# Altium project EMRT EVENT CONTROLER.PrjPCB (part 1 of 2)
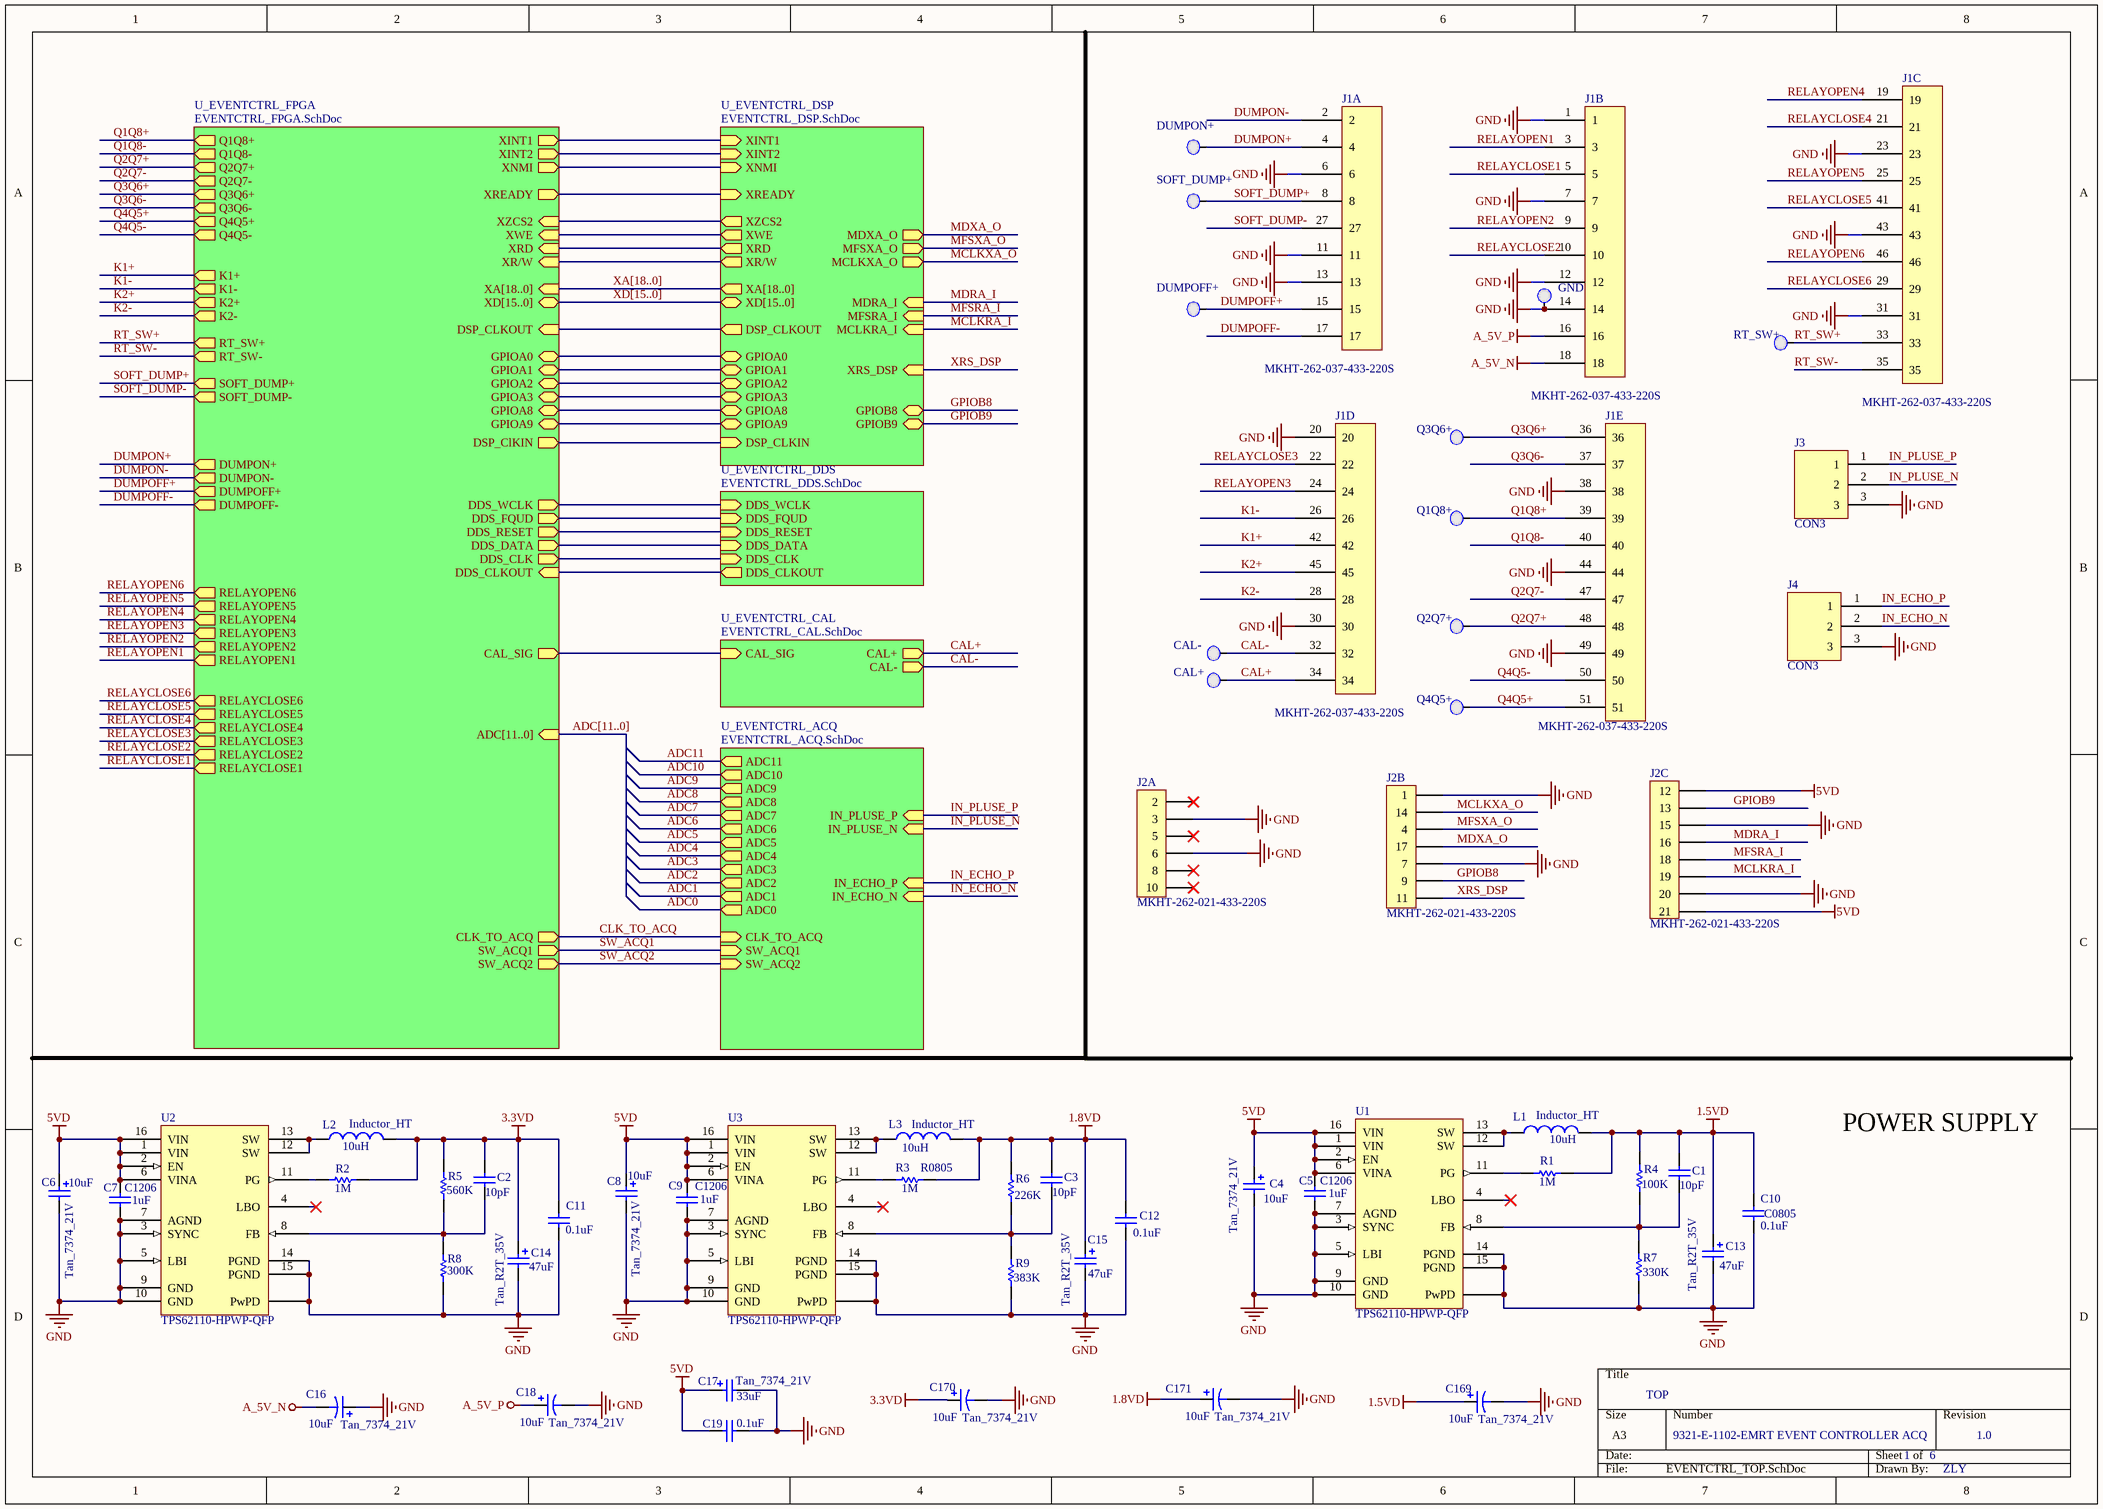
[diagram p0: EVENTCTRL_TOP.SchDoc]
6 sheets, 367 parts. Net scope: hierarchical (ports join the sheet entries above them; power ports are global).
Board file: Multi_EMRT_EC.PcbDoc
Sheets:
  EVENTCTRL_TOP.SchDoc
    U_EVENTCTRL_CAL = EVENTCTRL_CAL.SchDoc
    U_EVENTCTRL_DDS = EVENTCTRL_DDS.SchDoc
    U_EVENTCTRL_ACQ = EVENTCTRL_ACQ.SchDoc
    U_EVENTCTRL_DSP = EVENTCTRL_DSP.SchDoc
    U_EVENTCTRL_FPGA = EVENTCTRL_FPGA.SchDoc

## Sheet EVENTCTRL_TOP.SchDoc: TOP
size A3; Author: ZLY; DocumentNumber: 9321-E-1102-EMRT EVENT CONTROLLER ACQ; Revision: 1.0; SheetNumber: 1; SheetTotal: 6

### Parts
C1  value 10pF  [0805]  (hidden comment: C0805)
C2  value 10pF  [0805]  (hidden comment: C0805)
C3  value 10pF  [0805]  (hidden comment: C0805)
C4  Tan_7374_21V  value 10uF  [7343]
C5  C1206  value 1uF  [1206]
C6  Tan_7374_21V  value 10uF  [7343]
C7  C1206  value 1uF  [1206]
C8  Tan_7374_21V  value 10uF  [7343]
C9  C1206  value 1uF  [1206]
C10  C0805  value 0.1uF  [0805]
C11  value 0.1uF  [0805]  (hidden comment: C0805)
C12  value 0.1uF  [0805]  (hidden comment: C0805)
C13  Tan_R2T_35V  value 47uF  [7343]
C14  Tan_R2T_35V  value 47uF  [7343]
C15  Tan_R2T_35V  value 47uF  [7343]
C16  Tan_7374_21V  value 10uF  [7343]
C17  Tan_7374_21V  value 33uF  [7343]
C18  Tan_7374_21V  value 10uF  [7343]
C19  value 0.1uF  [0805]  (hidden comment: C0805)
C169  Tan_7374_21V  value 10uF  [7343]
C170  Tan_7374_21V  value 10uF  [7343]
C171  Tan_7374_21V  value 10uF  [7343]
CAL+  TP  [TPA]  (value not drawn)
CAL-  TP  [TPA]  (value not drawn)
DUMPOFF+  TP  [TPA]  (value not drawn)
DUMPON+  TP  [TPA]  (value not drawn)
GND  TP  [TPA]  (value not drawn)
J1  MKHT-262-037-433-220S  [MKHT-262-037-433-220S-51]  (parts A,B,C,D,E of 5)
J2  MKHT-262-021-433-220S  [AIRBORN_21]  (parts A,B,C of 3)
J3  CON3  [HEAT3]
J4  CON3  [HEAT3]
L1  Inductor_HT  value 10uH  [Inductor_HT]
L2  Inductor_HT  value 10uH  [Inductor_HT]
L3  Inductor_HT  value 10uH  [Inductor_HT]
Q1Q8+  TP  [TPA]  (value not drawn)
Q2Q7+  TP  [TPA]  (value not drawn)
Q3Q6+  TP  [TPA]  (value not drawn)
Q4Q5+  TP  [TPA]  (value not drawn)
R1  value 1M  [R0805]  (hidden comment: R0805)
R2  value 1M  [R0805]  (hidden comment: R0805)
R3  R0805  value 1M  [R0805]
R4  value 100K  [R0805]  (hidden comment: R0805)
R5  value 560K  [R0805]  (hidden comment: R0805)
R6  value 226K  [R0805]  (hidden comment: R0805)
R7  value 330K  [R0805]  (hidden comment: R0805)
R8  value 300K  [R0805]  (hidden comment: R0805)
R9  value 383K  [R0805]  (hidden comment: R0805)
RT_SW+  TP  [TPA]  (value not drawn)
SOFT_DUMP+  TP  [TPA]  (value not drawn)
U1  TPS62110-HPWP-QFP  [PWP16]
U2  TPS62110-HPWP-QFP  [PWP16]
U3  TPS62110-HPWP-QFP  [PWP16]

### Sub-sheets
U_EVENTCTRL_ACQ = EVENTCTRL_ACQ.SchDoc: IN_PLUSE_N (in), IN_PLUSE_P (in), IN_ECHO_N (in), IN_ECHO_P (in), SW_ACQ1 (in), SW_ACQ2 (in), CLK_TO_ACQ (in), ADC6 (out), ADC11 (out), ADC2 (out), ADC4 (out), ADC9 (out), ADC3 (out), ADC8 (out), ADC7 (out), ADC1 (out), ADC0 (out), ADC10 (out), ADC5 (out)
U_EVENTCTRL_CAL = EVENTCTRL_CAL.SchDoc: CAL_SIG (in), CAL+ (out), CAL- (out)
U_EVENTCTRL_DDS = EVENTCTRL_DDS.SchDoc: DDS_WCLK (in), DDS_FQUD (in), DDS_CLK (in), DDS_RESET (in), DDS_DATA (in), DDS_CLKOUT (out)
U_EVENTCTRL_DSP = EVENTCTRL_DSP.SchDoc: XZCS2 (out), XWE (out), XRD (out), XR/W (out), XREADY (in), DSP_CLKOUT (out), XINT1 (in), XINT2 (in), XNMI (in), GPIOA0 (bidir), GPIOA1 (bidir), GPIOA2 (bidir), GPIOA3 (bidir), MDXA_O (out), MFSXA_O (out), MCLKXA_O (out), MDRA_I (in), MFSRA_I (in), MCLKRA_I (in), XRS_DSP (in), XD[15..0] (bidir), XA[18..0] (out), GPIOB8 (bidir), GPIOB9 (bidir), GPIOA9 (bidir), GPIOA8 (bidir), DSP_CLKIN (in)
U_EVENTCTRL_FPGA = EVENTCTRL_FPGA.SchDoc: DDS_CLKOUT (in), XINT1 (out), XINT2 (out), XNMI (out), DDS_WCLK (out), DDS_FQUD (out), DDS_DATA (out), DDS_RESET (out), DSP_CLKOUT (in), XWE (in), XRD (in), GPIOA0 (bidir), GPIOA1 (bidir), GPIOA2 (bidir), GPIOA3 (bidir), XR/W (in), XREADY (out), XD[15..0] (bidir), XA[18..0] (in), Q1Q8+ (out), Q1Q8- (out), Q2Q7+ (out), Q2Q7- (out), Q3Q6+ (out), Q3Q6- (out), Q4Q5+ (out), Q4Q5- (out), DUMPON+ (out), DUMPON- (out), K1+ (out), K1- (out), RT_SW+ (out), RT_SW- (out), DUMPOFF+ (out), DUMPOFF- (out), K2+ (out), K2- (out), SOFT_DUMP+ (out), SOFT_DUMP- (out), GPIOA8 (bidir), GPIOA9 (bidir), CAL_SIG (out), SW_ACQ2 (out), SW_ACQ1 (out), CLK_TO_ACQ (out), DDS_CLK (out), XZCS2 (in), ADC[11..0] (in), RELAYOPEN6 (out), RELAYCLOSE4 (out), RELAYCLOSE6 (out), RELAYOPEN4 (out), RELAYCLOSE5 (out), RELAYOPEN1 (out), RELAYCLOSE2 (out), RELAYOPEN5 (out), RELAYCLOSE1 (out), RELAYOPEN3 (out), RELAYCLOSE3 (out), RELAYOPEN2 (out), DSP_ClKIN (out)

### Nets
1.5VD: C1.2 C10.2 C13.1 C169.1 L1.2 R1.2 R4.2
1.8VD: C3.2 C12.2 C15.1 C171.1 L3.2 R3.2 R6.2
3.3VD: C2.2 C11.2 C14.1 C170.1 L2.2 R2.2 R5.2
5VD: C4.1 C5.2 C6.1 C7.2 C8.1 C9.2 C17.1 C19.2 J2.12 J2.21 U1.1(VIN) U1.2(EN) U1.6(VINA) U1.16(VIN) U2.1(VIN) U2.2(EN) U2.6(VINA) U2.16(VIN) U3.1(VIN) U3.2(EN) U3.6(VINA) U3.16(VIN)
A_5V_N: C16.2 J1.18
A_5V_P: C18.1 J1.16
GND: C4.2 C5.1 C6.2 C7.1 C8.2 C9.1 C10.1 C11.1 C12.1 C13.2 C14.2 C15.2 C16.1 C17.2 C18.2 C19.1 C169.2 C170.2 C171.2 GND.1(TP) J1.1 J1.6 J1.7 J1.11 J1.12 J1.13 J1.14 J1.20 J1.23 J1.30 J1.31 J1.38 J1.43 J1.44 J1.49 J2.1 J2.3 J2.6 J2.7 J2.15 J2.20 J3.3 J4.3 R7.1 R8.1 R9.1 U1.3(SYNC) U1.5(LBI) U1.7(AGND) U1.9(GND) U1.10(GND) U1.14(PGND) U1.15(PGND) U1.PwPD U2.3(SYNC) U2.5(LBI) U2.7(AGND) U2.9(GND) U2.10(GND) U2.14(PGND) U2.15(PGND) U2.PwPD U3.3(SYNC) U3.5(LBI) U3.7(AGND) U3.9(GND) U3.10(GND) U3.14(PGND) U3.15(PGND) U3.PwPD
CAL+: CAL+.1(TP) J1.34 ; sheet U_EVENTCTRL_CAL/CAL+
CAL-: CAL-.1(TP) J1.32 ; sheet U_EVENTCTRL_CAL/CAL-
CLK_TO_ACQ: sheet U_EVENTCTRL_ACQ/CLK_TO_ACQ, sheet U_EVENTCTRL_FPGA/CLK_TO_ACQ
DUMPOFF+: DUMPOFF+.1(TP) J1.15 ; sheet U_EVENTCTRL_FPGA/DUMPOFF+
DUMPOFF-: J1.17 ; sheet U_EVENTCTRL_FPGA/DUMPOFF-
DUMPON+: DUMPON+.1(TP) J1.4 ; sheet U_EVENTCTRL_FPGA/DUMPON+
DUMPON-: J1.2 ; sheet U_EVENTCTRL_FPGA/DUMPON-
GPIOB8: J2.9 ; sheet U_EVENTCTRL_DSP/GPIOB8
GPIOB9: J2.13 ; sheet U_EVENTCTRL_DSP/GPIOB9
IN_ECHO_N: J4.2 ; sheet U_EVENTCTRL_ACQ/IN_ECHO_N
IN_ECHO_P: J4.1 ; sheet U_EVENTCTRL_ACQ/IN_ECHO_P
IN_PLUSE_N: J3.2 ; sheet U_EVENTCTRL_ACQ/IN_PLUSE_N
IN_PLUSE_P: J3.1 ; sheet U_EVENTCTRL_ACQ/IN_PLUSE_P
K1+: J1.42 ; sheet U_EVENTCTRL_FPGA/K1+
K1-: J1.26 ; sheet U_EVENTCTRL_FPGA/K1-
K2+: J1.45 ; sheet U_EVENTCTRL_FPGA/K2+
K2-: J1.28 ; sheet U_EVENTCTRL_FPGA/K2-
MCLKRA_I: J2.19 ; sheet U_EVENTCTRL_DSP/MCLKRA_I  [project net MCLKRA]
MCLKXA_O: J2.14 ; sheet U_EVENTCTRL_DSP/MCLKXA_O  [project net MCLKXA]
MDRA_I: J2.16 ; sheet U_EVENTCTRL_DSP/MDRA_I  [project net MDRA]
MDXA_O: J2.17 ; sheet U_EVENTCTRL_DSP/MDXA_O  [project net MDXA]
MFSRA_I: J2.18 ; sheet U_EVENTCTRL_DSP/MFSRA_I  [project net MFSRA]
MFSXA_O: J2.4 ; sheet U_EVENTCTRL_DSP/MFSXA_O  [project net MFSXA]
Q1Q8+: J1.39 Q1Q8+.1(TP) ; sheet U_EVENTCTRL_FPGA/Q1Q8+
Q1Q8-: J1.40 ; sheet U_EVENTCTRL_FPGA/Q1Q8-
Q2Q7+: J1.48 Q2Q7+.1(TP) ; sheet U_EVENTCTRL_FPGA/Q2Q7+
Q2Q7-: J1.47 ; sheet U_EVENTCTRL_FPGA/Q2Q7-
Q3Q6+: J1.36 Q3Q6+.1(TP) ; sheet U_EVENTCTRL_FPGA/Q3Q6+
Q3Q6-: J1.37 ; sheet U_EVENTCTRL_FPGA/Q3Q6-
Q4Q5+: J1.51 Q4Q5+.1(TP) ; sheet U_EVENTCTRL_FPGA/Q4Q5+
Q4Q5-: J1.50 ; sheet U_EVENTCTRL_FPGA/Q4Q5-
RELAYCLOSE1: J1.5 ; sheet U_EVENTCTRL_FPGA/RELAYCLOSE1
RELAYCLOSE2: J1.10 ; sheet U_EVENTCTRL_FPGA/RELAYCLOSE2
RELAYCLOSE3: J1.22 ; sheet U_EVENTCTRL_FPGA/RELAYCLOSE3
RELAYCLOSE4: J1.21 ; sheet U_EVENTCTRL_FPGA/RELAYCLOSE4
RELAYCLOSE5: J1.41 ; sheet U_EVENTCTRL_FPGA/RELAYCLOSE5
RELAYCLOSE6: J1.29 ; sheet U_EVENTCTRL_FPGA/RELAYCLOSE6
RELAYOPEN1: J1.3 ; sheet U_EVENTCTRL_FPGA/RELAYOPEN1
RELAYOPEN2: J1.9 ; sheet U_EVENTCTRL_FPGA/RELAYOPEN2
RELAYOPEN3: J1.24 ; sheet U_EVENTCTRL_FPGA/RELAYOPEN3
RELAYOPEN4: J1.19 ; sheet U_EVENTCTRL_FPGA/RELAYOPEN4
RELAYOPEN5: J1.25 ; sheet U_EVENTCTRL_FPGA/RELAYOPEN5
RELAYOPEN6: J1.46 ; sheet U_EVENTCTRL_FPGA/RELAYOPEN6
RT_SW+: J1.33 RT_SW+.1(TP) ; sheet U_EVENTCTRL_FPGA/RT_SW+
RT_SW-: J1.35 ; sheet U_EVENTCTRL_FPGA/RT_SW-
SOFT_DUMP+: J1.8 SOFT_DUMP+.1(TP) ; sheet U_EVENTCTRL_FPGA/SOFT_DUMP+
SOFT_DUMP-: J1.27 ; sheet U_EVENTCTRL_FPGA/SOFT_DUMP-
SW_ACQ1: sheet U_EVENTCTRL_ACQ/SW_ACQ1, sheet U_EVENTCTRL_FPGA/SW_ACQ1
SW_ACQ2: sheet U_EVENTCTRL_ACQ/SW_ACQ2, sheet U_EVENTCTRL_FPGA/SW_ACQ2
XR/W: sheet U_EVENTCTRL_DSP/XR/W, sheet U_EVENTCTRL_FPGA/XR/W
XRD: sheet U_EVENTCTRL_DSP/XRD, sheet U_EVENTCTRL_FPGA/XRD
XRS_DSP: J2.11 ; sheet U_EVENTCTRL_DSP/XRS_DSP
XWE: sheet U_EVENTCTRL_DSP/XWE, sheet U_EVENTCTRL_FPGA/XWE
NetC1_1: C1.1 R4.1 R7.2 U1.8(FB)
NetC2_1: C2.1 R5.1 R8.2 U2.8(FB)
NetC3_1: C3.1 R6.1 R9.2 U3.8(FB)
NetL1_1: L1.1 U1.12(SW) U1.13(SW)
NetL2_1: L2.1 U2.12(SW) U2.13(SW)
NetL3_1: L3.1 U3.12(SW) U3.13(SW)
NetR1_1: R1.1 U1.11(PG)
NetR2_1: R2.1 U2.11(PG)
NetR3_1: R3.1 U3.11(PG)
NetR90_1: sheet U_EVENTCTRL_CAL/CAL_SIG, sheet U_EVENTCTRL_FPGA/CAL_SIG
NetR107_1: sheet U_EVENTCTRL_DSP/DSP_CLKOUT, sheet U_EVENTCTRL_FPGA/DSP_CLKOUT
NetR109_1: sheet U_EVENTCTRL_DSP/GPIOA0, sheet U_EVENTCTRL_FPGA/GPIOA0
NetR110_1: sheet U_EVENTCTRL_DSP/GPIOA1, sheet U_EVENTCTRL_FPGA/GPIOA1
NetR111_1: sheet U_EVENTCTRL_DSP/GPIOA2, sheet U_EVENTCTRL_FPGA/GPIOA2
NetR112_1: sheet U_EVENTCTRL_DSP/GPIOA3, sheet U_EVENTCTRL_FPGA/GPIOA3
NetR113_1: sheet U_EVENTCTRL_DSP/GPIOA8, sheet U_EVENTCTRL_FPGA/GPIOA8
NetR114_1: sheet U_EVENTCTRL_DSP/GPIOA9, sheet U_EVENTCTRL_FPGA/GPIOA9
NetR116_1: sheet U_EVENTCTRL_DSP/XINT1, sheet U_EVENTCTRL_FPGA/XINT1
NetR118_1: sheet U_EVENTCTRL_DSP/XINT2, sheet U_EVENTCTRL_FPGA/XINT2
NetR120_1: sheet U_EVENTCTRL_DSP/XNMI, sheet U_EVENTCTRL_FPGA/XNMI
NetR134_1: sheet U_EVENTCTRL_DSP/DSP_CLKIN, sheet U_EVENTCTRL_FPGA/DSP_ClKIN
NetTP21_1: sheet U_EVENTCTRL_DDS/DDS_CLK, sheet U_EVENTCTRL_FPGA/DDS_CLK
NetTP22_1: sheet U_EVENTCTRL_DDS/DDS_CLKOUT, sheet U_EVENTCTRL_FPGA/DDS_CLKOUT
NetU15_7: sheet U_EVENTCTRL_DDS/DDS_WCLK, sheet U_EVENTCTRL_FPGA/DDS_WCLK
NetU15_8: sheet U_EVENTCTRL_DDS/DDS_FQUD, sheet U_EVENTCTRL_FPGA/DDS_FQUD
NetU15_22: sheet U_EVENTCTRL_DDS/DDS_RESET, sheet U_EVENTCTRL_FPGA/DDS_RESET
NetU15_25: sheet U_EVENTCTRL_DDS/DDS_DATA, sheet U_EVENTCTRL_FPGA/DDS_DATA
NetU16_88: sheet U_EVENTCTRL_DSP/XZCS2, sheet U_EVENTCTRL_FPGA/XZCS2
NetU16_161: sheet U_EVENTCTRL_DSP/XREADY, sheet U_EVENTCTRL_FPGA/XREADY

Not connected (* = marked no-connect by the designer): J2 2* 5* 8* 10*; U1 4(LBO)*; U2 4(LBO)*; U3 4(LBO)*

### Buses and harness runs
bus ADC[11..0] = sheet U_EVENTCTRL_FPGA/ADC[11..0]
bus XA[18..0] = sheet U_EVENTCTRL_DSP/XA[18..0] = sheet U_EVENTCTRL_FPGA/XA[18..0]
bus XD[15..0] = sheet U_EVENTCTRL_DSP/XD[15..0] = sheet U_EVENTCTRL_FPGA/XD[15..0]

### Notes on the sheet
- POWER SUPPLY

### Library data of the parts
C1-C3 = Y20025162: Capacitor; 制造商型号: 0805D100J500P; parent: 01; 精度: ±5%; 描述: NOVACAP;0805D100J500P;10pF;30±ppm/℃;±5%;50V;C0G/NP0;200℃;CAP0805; 安装形式: SMT; 湿敏等级（回流焊峰值）: 0; 产品外形尺寸<长>: 0.080±0.008 in; 产品外形尺寸<宽>: 0.050±0.008 in; 产品外形尺寸<高>: 0.054 in; id: wt.part.WTPartMaster:1047283; state: APPROVED; folder: /Default/电容/0805D100J500P; Part Number: Y20025162; HelpURL: \\10.185.226.160\altium_center_db\DATASHEET\NOVACAP High Temperature Chip.pdf; Library Path: Cap.SchLib; Library Ref: Cap; Footprint Path: NOVACAP 0805.PcbLib; Footprint Ref: CAPS0805_54; pname: 0805D100J500P; Library Path 2: 0; Library Ref 2: 0; Footprint Path 2: 0; Footprint Ref 2: 0; Footprint Path 3: 0; Footprint Ref 3: 0
C4 C6 C8 = Y20024815: Polarized Capacitor; 制造商型号: T499C106K025AT; parent: 01; 精度: ±10%; 描述: KEMET;T499C106K025AT;10uF;±10%;25V;175℃;CAP2312; 安装形式: SMT; 湿敏等级（回流焊峰值）: 0; 产品外形尺寸<长>: 3.2±0.30 mm; 产品外形尺寸<宽>: 6.0±0.30 mm; 产品外形尺寸<高>: 2.5±0.30 mm; id: wt.part.WTPartMaster:1056571; state: APPROVED; folder: /Default/电容/T499C106K025AT; 耐压值: 21V; Part Number: Y20024815; HelpURL: \\10.185.226.160\altium_center_db\DATASHEET\KEMET T498&T499ns.pdf; Library Path: Cap Pol.SchLib; Library Ref: Cap Pol; Footprint Path: KEMET T499-C.PcbLib; Footprint Ref: CAPSP_2q2312_110; pname: T499C106K025AT; Library Path 2: 0; Library Ref 2: 0; Footprint Path 2: 0; Footprint Ref 2: 0; Footprint Path 3: 0; Footprint Ref 3: 0
C5 C7 C9 = Y20024113: Capacitor; 制造商型号: C1206C105K5RAC; parent: 01; 精度: ±10%; 描述: KEMET;C1206C105K5RAC;1uF;±10%;50V;X7R;125℃;CAP1206 MSL1; 安装形式: SMT; 湿敏等级（回流焊峰值）: MSL1; 产品外形尺寸<长>: 3.2±0.2 mm; 产品外形尺寸<宽>: 1.6±0.2 mm; 产品外形尺寸<高>: 1.0±0.1 mm; Library Path 2: 0; id: wt.part.WTPartMaster:1055130; state: APPROVED; folder: /Default/电容/C1206C105K5RAC; Part Number: Y20024113; HelpURL: \\10.185.226.160\altium_center_db\DATASHEET\KEMET X7R Dielectric(Commercial Grade).pdf; Library Path: Cap.SchLib; Library Ref: Cap; Footprint Path: KEMET C1206_43.PcbLib; Footprint Ref: CAPS1206_43; pname: C1206C105K5RAC; Library Ref 2: 0; Footprint Path 2: 0; Footprint Ref 2: 0; Footprint Path 3: 0; Footprint Ref 3: 0
C10-C12 C19 = Y20025084: Capacitor; 制造商型号: VJ0805H104KXA; parent: 01; 精度: ±10%; 描述: VISHAY;VJ0805H104KXA;0.1uF;±10%;50V;X8R;150℃;CAP0805; 安装形式: SMT; 湿敏等级（回流焊峰值）: 0; 产品外形尺寸<长>: 0.079±0.008 in; 产品外形尺寸<宽>: 0.049±0.008 in; 产品外形尺寸<高>: 0.057 in; id: wt.part.WTPartMaster:1053152; state: APPROVED; folder: /Default/电容/VJ0805H104KXA; Part Number: Y20025084; HelpURL: \\10.185.226.160\altium_center_db\DATASHEET\VISHAY VJ X8R.pdf; Library Path: Cap.SchLib; Library Ref: Cap; Footprint Path: VISHAY VJ0805_57.PcbLib; Footprint Ref: CAPS0805_57; pname: VJ0805H104KXA; Library Path 2: 0; Library Ref 2: 0; Footprint Path 2: 0; Footprint Ref 2: 0; Footprint Path 3: 0; Footprint Ref 3: 0
C13 C14 = Y20024816: Polarized Capacitor; 制造商型号: T499D476K016AT; parent: 01; 精度: ±10%; 描述: KEMET;T499D476K016AT;47uF;±10%;16V;175℃;CAP2917; 安装形式: SMT; 湿敏等级（回流焊峰值）: 0; 产品外形尺寸<长>: 7.3±0.30 mm; 产品外形尺寸<宽>: 4.3±0.30 mm; 产品外形尺寸<高>: 2.8±0.30 mm; id: wt.part.WTPartMaster:1056620; state: APPROVED; folder: /Default/电容/T499D476K016AT; Part Number: Y20024816; HelpURL: \\10.185.226.160\altium_center_db\DATASHEET\KEMET T498&T499ns.pdf; Library Path: Cap Pol.SchLib; Library Ref: Cap Pol; Footprint Path: KEMET T499-D.PcbLib; Footprint Ref: CAPSP_2q2917_122; pname: T499D476K016AT; Library Path 2: 0; Library Ref 2: 0; Footprint Path 2: 0; Footprint Ref 2: 0; Footprint Path 3: 0; Footprint Ref 3: 0
  C14: Footprint: R2T
C15 = Y20024816: Polarized Capacitor; 制造商型号: T499D476K016AT; parent: 01; 精度: ±10%; 描述: KEMET;T499D476K016AT;47uF;±10%;16V;175℃;CAP2917; 安装形式: SMT; 湿敏等级（回流焊峰值）: 0; 产品外形尺寸<长>: 7.3±0.30 mm; 产品外形尺寸<宽>: 4.3±0.30 mm; 产品外形尺寸<高>: 2.8±0.30 mm; id: wt.part.WTPartMaster:1056620; state: APPROVED; folder: /Default/电容/T499D476K016AT; 耐压值: 35V; Part Number: Y20024816; HelpURL: \\10.185.226.160\altium_center_db\DATASHEET\KEMET T498&T499ns.pdf; Library Path: Cap Pol.SchLib; Library Ref: Cap Pol; Footprint Path: KEMET T499-D.PcbLib; Footprint Ref: CAPSP_2q2917_122; pname: T499D476K016AT; Library Path 2: 0; Library Ref 2: 0; Footprint Path 2: 0; Footprint Ref 2: 0; Footprint Path 3: 0; Footprint Ref 3: 0
C16 C18 C169-C171 = Cap Pol1: Polarized Capacitor (Radial); 耐压值: 21V
C17 = Y20028884: Polarized Capacitor; 制造商型号: 593D336X9025D2TE3; parent: 01; 精度: ±10%; 描述: VISHAY;593D336X9025D2TE3;33uF; ±10%;25V;125℃;CAP2917; 安装形式: SMT; 湿敏等级（回流焊峰值）: 0; 产品外形尺寸<长>: 7.3±0.3 mm; 产品外形尺寸<宽>: 4.3±0.3 mm; 产品外形尺寸<高>: 2.8±0.3 mm; id: wt.part.WTPartMaster:2265816; state: APPROVED; folder: /Default/电容/593D336X9025D2TE3; 耐压值: 35V; Part Number: Y20028884; HelpURL: \\10.185.226.160\altium_center_db\DATASHEET\VISHAY 593D.pdf; Library Path: Cap Pol.SchLib; Library Ref: Cap Pol; Footprint Path: VISHAY 593D.PcbLib; Footprint Ref: CAPSP_2q2917_122; pname: 593D336X9025D2TE3; Library Path 2: 0; Library Ref 2: 0; Footprint Path 2: 0; Footprint Ref 2: 0; Footprint Path 3: 0; Footprint Ref 3: 0
L1-L3 = Y20028214: Inductor-1; parent: 10; 描述: EPCOS;B82422H1103K000;10uH INDUCTOR SIMID 1210?H; 安装形式: SMT; 引脚数目: 2; 最低温度: 0°C; 产品外形尺寸<长>: 3.2 mm; 产品外形尺寸<宽>: 2.5 mm; 产品外形尺寸<高>: 2.2 mm; 主要参数: LR=10uH;IR=0.5A;RMAX=0.46Ω;fres,min=30MHz;Qmin=12;电感容差=±10%; pname: B82422H1103K; Library Path 2: 0; id: wt.part.WTPartMaster:1042867; state: APPROVED; folder: /lijun/Checked Out/B82422H1103K; Part Number: Y20028214; 制造商型号: B82422H1103K000; HelpURL: \\10.185.226.160\altium_center_db\DATASHEET\EPCOS B82422H.pdf; Library Path: B82422H1103K000.SchLib; Library Ref: B82422H1103K000; Footprint Path: EPCOS B82422H1103K000.PcbLib; Footprint Ref: INDS 1210-H_95; Library Ref 2: 0; Footprint Path 2: 0; Footprint Ref 2: 0; Footprint Path 3: 0; Footprint Ref 3: 0
R1-R9 = Res1: Resistor; Published: 8-Jun-2000; LatestRevisionDate: 17-Jul-2002; LatestRevisionNote: Re-released for DXP Platform.; PackageReference: AXIAL-0.3; Publisher: Altium Limited; PackageDescription: Axial Device, Thru-Hole; 2 Leads; 0.3 in Pin Spacing
U1-U3 = Y20033002: 安装形式: SMT; 产品外形尺寸<高>: 1.2mm; 产品外形尺寸<长>: 6.6mm; 产品外形尺寸<宽>: 5.1mm; 引脚数目: 16; 湿敏等级（回流焊峰值）: MSL2(260C); 描述: TI;TPS62110-HPWP;175℃;HTSSOP 16PINS;MSL2(260C); id: wt.part.WTPartMaster:8901760; folder: /Default/电源及电源管理/TPS62110HPWP; 主要参数: 17-V, 1.5-A, SYNCHRONOUS STEP-DOWN CONVERTER; state: APPROVED; parent: 13; Library Path 2: 0; Part Number: Y20033002; Library Ref: TPS62110-HPWP; Footprint Path: 0; HelpURL: \\10.185.226.160\altium_center_db\DATASHEET\TI TPS62110-HT.pdf; Footprint Ref: 0; Library Path: TPS62110-HT.SchLib; 制造商型号: TPS62110-HPWP; pname: TPS62110-HPWP; Library Ref 2: 0; Footprint Path 2: 0; Footprint Ref 2: 0; Footprint Path 3: 0; Footprint Ref 3: 0

## Sheet EVENTCTRL_CAL.SchDoc: CAL
size A4; Author: ZLY; DocumentNumber: 9321-E-1102-EMRT EVENT CONTROLLER ACQ; Revision: 1.0; SheetNumber: 3; SheetTotal: 6
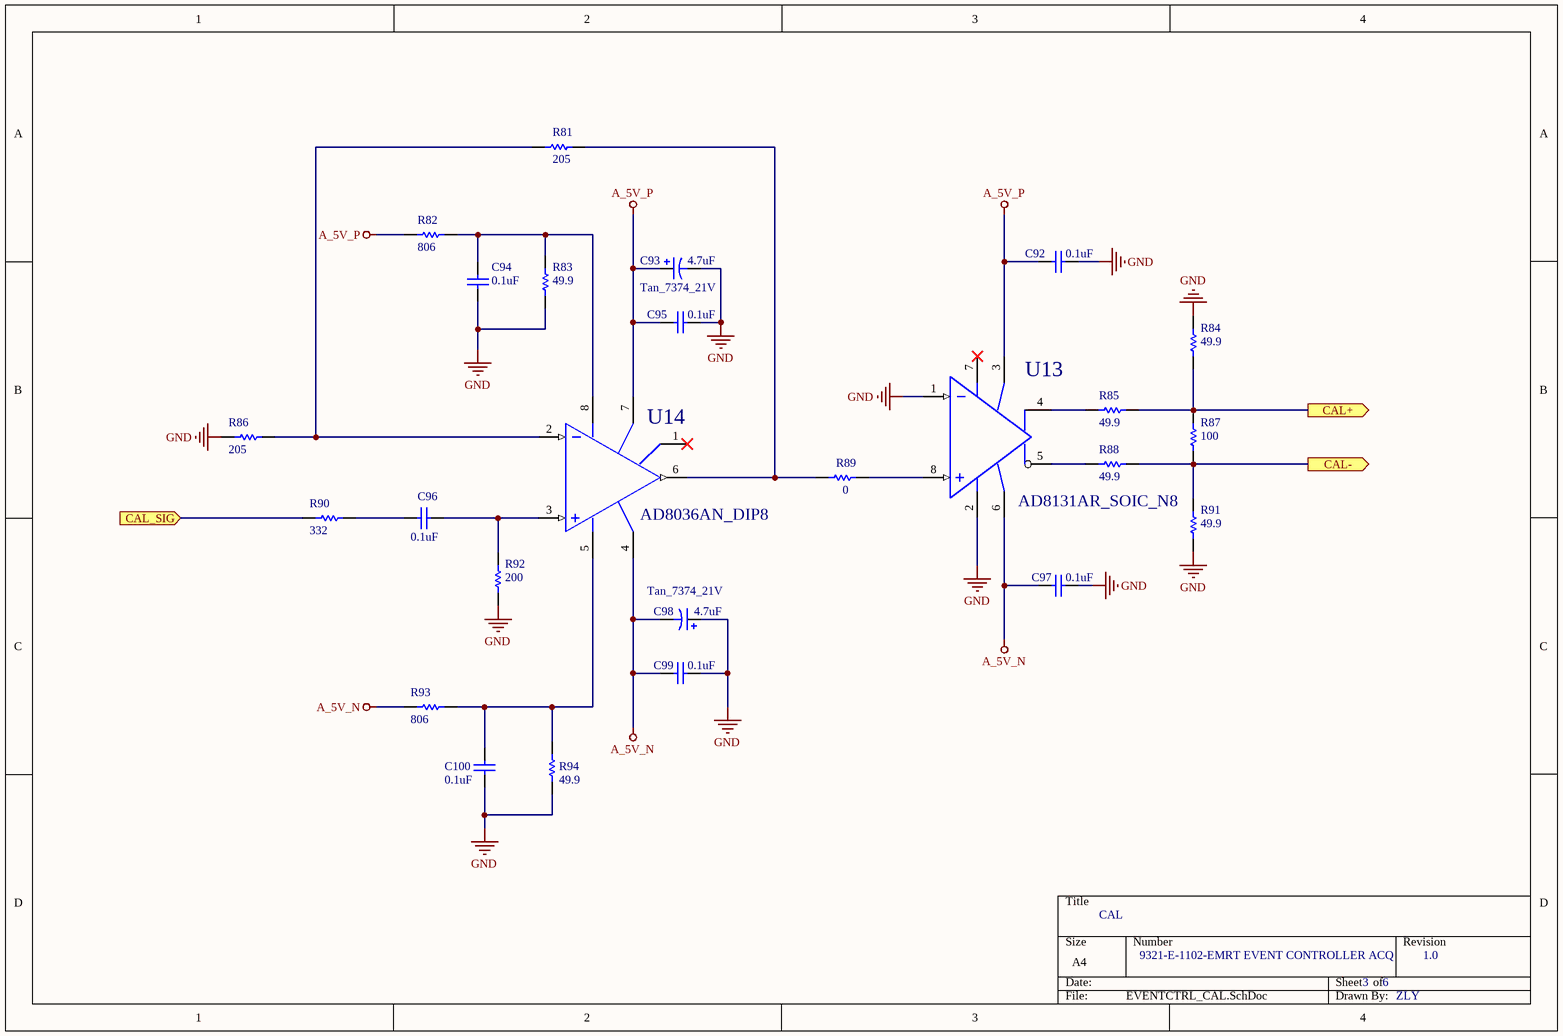
[diagram p1: EVENTCTRL_CAL.SchDoc]

### Parts
C92  value 0.1uF  [0805]  (hidden comment: C0805)
C93  Tan_7374_21V  value 4.7uF  [7343]
C94  value 0.1uF  [0805]  (hidden comment: C0805)
C95  value 0.1uF  [0805]  (hidden comment: C0805)
C96  value 0.1uF  [0805]  (hidden comment: C0805)
C97  value 0.1uF  [0805]  (hidden comment: C0805)
C98  Tan_7374_21V  value 4.7uF  [7343]
C99  value 0.1uF  [0805]  (hidden comment: C0805)
C100  value 0.1uF  [0805]  (hidden comment: C0805)
R81  value 205  [R0805]  (hidden comment: R0805)
R82  value 806  [R0805]  (hidden comment: R0805)
R83  value 49.9  [R0805]  (hidden comment: R0805)
R84  value 49.9  [R0805]  (hidden comment: R0805)
R85  value 49.9  [R0805]  (hidden comment: R0805)
R86  value 205  [R0805]  (hidden comment: R0805)
R87  value 100  [R0805]  (hidden comment: R0805)
R88  value 49.9  [R0805]  (hidden comment: R0805)
R89  value 0  [R0805]  (hidden comment: R0805)
R90  value 332  [R0805]  (hidden comment: R0805)
R91  value 49.9  [R0805]  (hidden comment: R0805)
R92  value 200  [R0805]  (hidden comment: R0805)
R93  value 806  [R0805]  (hidden comment: R0805)
R94  value 49.9  [R0805]  (hidden comment: R0805)
U13  AD8131AR_SOIC_N8  [SO-8]
U14  AD8036AN_DIP8  [DIP8]

### Ports
CAL+ (out), CAL- (out), CAL_SIG (in)

### Nets
A_5V_N: C97.1 C98.2 C99.1 R93.1 U13.6(V-) U14.4(V-)
A_5V_P: C92.1 C93.1 C95.1 R82.1 U13.3(V+) U14.7(V+)
GND: C92.2 C93.2 C94.1 C95.2 C97.2 C98.1 C99.2 C100.1 R83.1 R84.2 R86.1 R91.1 R92.1 R94.1 U13.1(Din-) U13.2(Vcom)
CAL+: R84.1 R85.2 R87.2 ; port CAL+
CAL-: R87.1 R88.2 R91.2 ; port CAL-
NetC94_2: C94.2 R82.2 R83.2 U14.8(V+)
NetC96_1: C96.1 R90.2
NetC96_2: C96.2 R92.2 U14.3(IN+)
NetC100_2: C100.2 R93.2 R94.2 U14.5(V-)
NetR81_1: R81.1 R86.2 U14.2(IN-)
NetR81_2: R81.2 R89.1 U14.6(OUT)
NetR85_1: R85.1 U13.4(OUT+)
NetR88_1: R88.1 U13.5(OUT-)
NetR89_2: R89.2 U13.8(Din+)
NetR90_1: R90.1 ; port CAL_SIG

Not connected (* = marked no-connect by the designer): U13 7(NC)*; U14 1(NC)*

### Library data of the parts
C92 C94-C97 C99 C100 = Cap: Capacitor; PackageReference: C0805
C93 C98 = Cap Pol1: Polarized Capacitor (Radial)
R81-R94 = Res1: Resistor; PackageReference: R0805
U13 = AD8131AR
U14 = AD8036AN

## Sheet EVENTCTRL_DDS.SchDoc: DDS
size A4; Author: ZLY; DocumentNumber: 9321-E-1102-EMRT EVENT CONTROLLER ACQ; Revision: 1.0; SheetNumber: 4; SheetTotal: 6
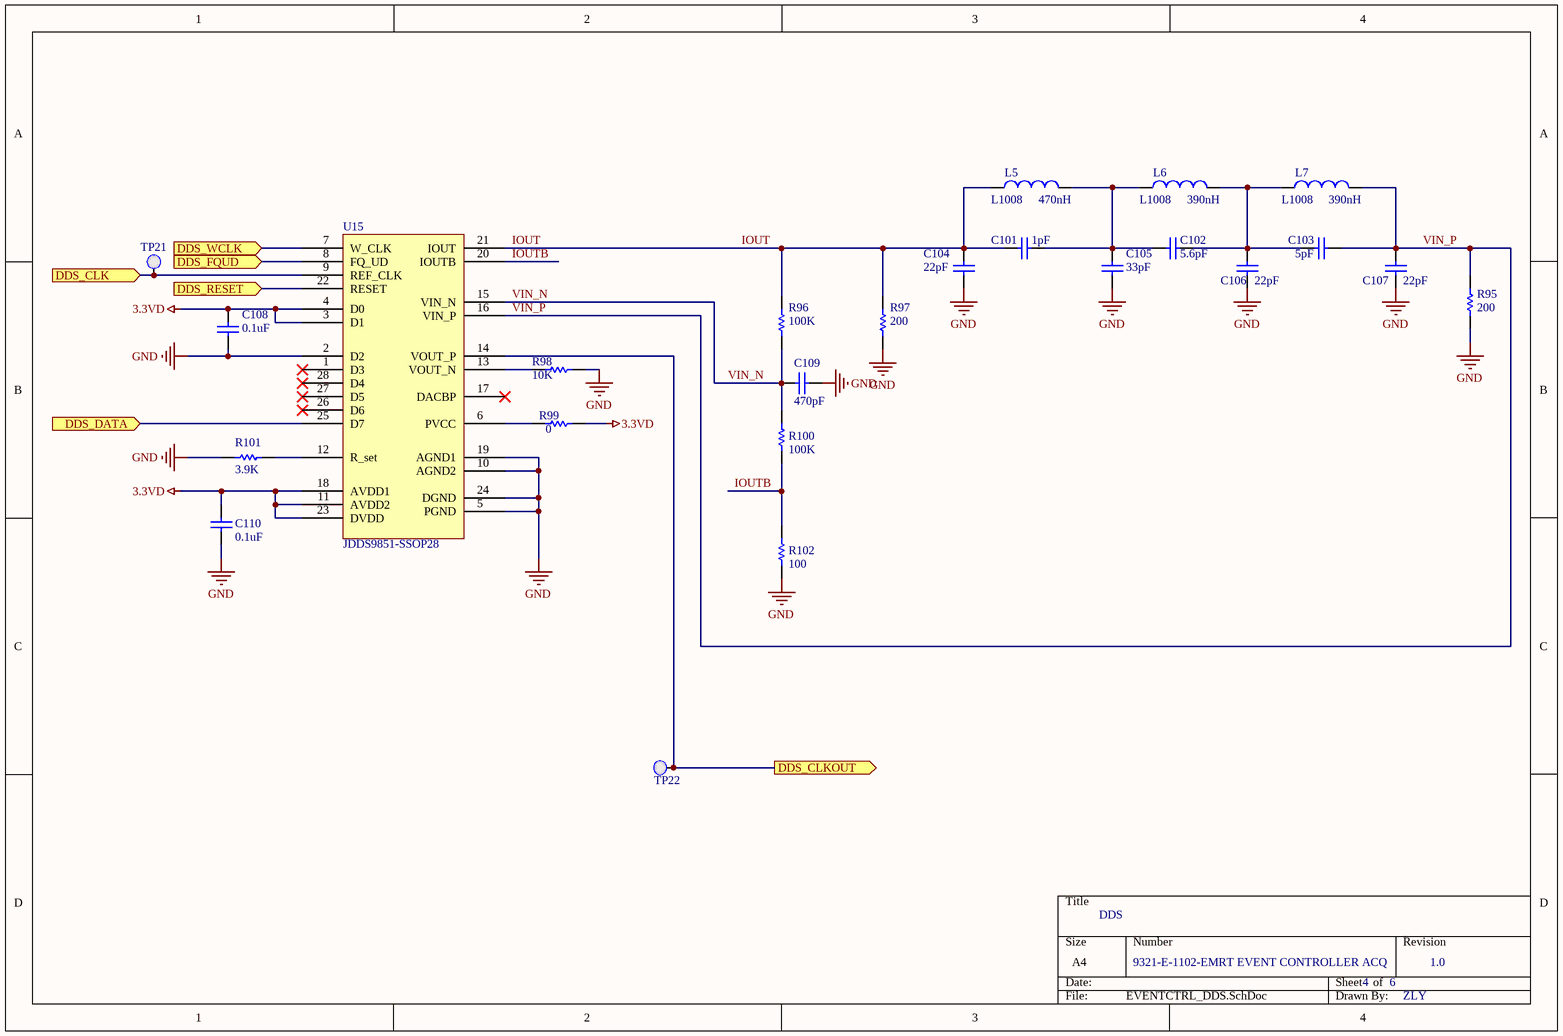
[diagram p2: EVENTCTRL_DDS.SchDoc]

### Parts
C101  value 1pF  [0805]  (hidden comment: C0805)
C102  value 5.6pF  [0805]  (hidden comment: C0805)
C103  value 5pF  [0805]  (hidden comment: C0805)
C104  value 22pF  [0805]  (hidden comment: C0805)
C105  value 33pF  [0805]  (hidden comment: C0805)
C106  value 22pF  [0805]  (hidden comment: C0805)
C107  value 22pF  [0805]  (hidden comment: C0805)
C108  value 0.1uF  [0805]  (hidden comment: C0805)
C109  value 470pF  [0805]  (hidden comment: C0805)
C110  value 0.1uF  [0805]  (hidden comment: C0805)
L5  L1008  value 470nH  [1008]
L6  L1008  value 390nH  [1008]
L7  L1008  value 390nH  [1008]
R95  value 200  [R0805]  (hidden comment: R0805)
R96  value 100K  [R0805]  (hidden comment: R0805)
R97  value 200  [R0805]  (hidden comment: R0805)
R98  value 10K  [R0805]  (hidden comment: R0805)
R99  value 0  [R0805]  (hidden comment: R0805)
R100  value 100K  [R0805]  (hidden comment: R0805)
R101  value 3.9K  [R0805]  (hidden comment: R0805)
R102  value 100  [R0805]  (hidden comment: R0805)
TP21  TP  [TPA]  (value not drawn)
TP22  TP  [TPA]  (value not drawn)
U15  JDDS9851-SSOP28  [TSSOP28]

### Ports
DDS_CLK (in), DDS_CLKOUT (out), DDS_DATA (in), DDS_FQUD (in), DDS_RESET (in), DDS_WCLK (in)

### Nets
3.3VD: C108.2 C110.2 R99.2 U15.3(D1) U15.4(D0) U15.11(AVDD2) U15.18(AVDD1) U15.23(DVDD)
GND: C104.1 C105.1 C106.1 C107.1 C108.1 C109.1 C110.1 R95.1 R97.1 R98.2 R101.1 R102.1 U15.2(D2) U15.5(PGND) U15.10(AGND2) U15.19(AGND1) U15.24(DGND)
IOUT: C101.1 C104.2 L5.1 R96.2 R97.2 U15.21(IOUT)
IOUTB: R100.1 R102.2 U15.20(IOUTB)
VIN_N: C109.2 R96.1 R100.2 U15.15(VIN_N)
VIN_P: C103.2 C107.2 L7.2 R95.2 U15.16(VIN_P)
NetC101_2: C101.2 C102.1 C105.2 L5.2 L6.1
NetC102_2: C102.2 C103.1 C106.2 L6.2 L7.1
NetR98_1: R98.1 U15.13(VOUT_N)
NetR99_1: R99.1 U15.6(PVCC)
NetR101_2: R101.2 U15.12(R_set)
NetTP21_1: TP21.1(TP) U15.9(REF_CLK) ; port DDS_CLK
NetTP22_1: TP22.1(TP) U15.14(VOUT_P) ; port DDS_CLKOUT
NetU15_7: U15.7(W_CLK) ; port DDS_WCLK
NetU15_8: U15.8(FQ_UD) ; port DDS_FQUD
NetU15_22: U15.22(RESET) ; port DDS_RESET
NetU15_25: U15.25(D7) ; port DDS_DATA

Not connected (* = marked no-connect by the designer): U15 1(D3)* 17(DACBP)* 26(D6)* 27(D5)* 28(D4)*

### Library data of the parts
C101-C110 = Cap: Capacitor; PackageReference: C0805
L5-L7 = Inductor
R95-R102 = Res1: Resistor; PackageReference: R0805
U15 = JS9851

## Sheet EVENTCTRL_ACQ.SchDoc: ACQ
size A2; Author: ZLY; DocumentNumber: 2; Revision: 1.0; SheetNumber: 2; SheetTotal: 6
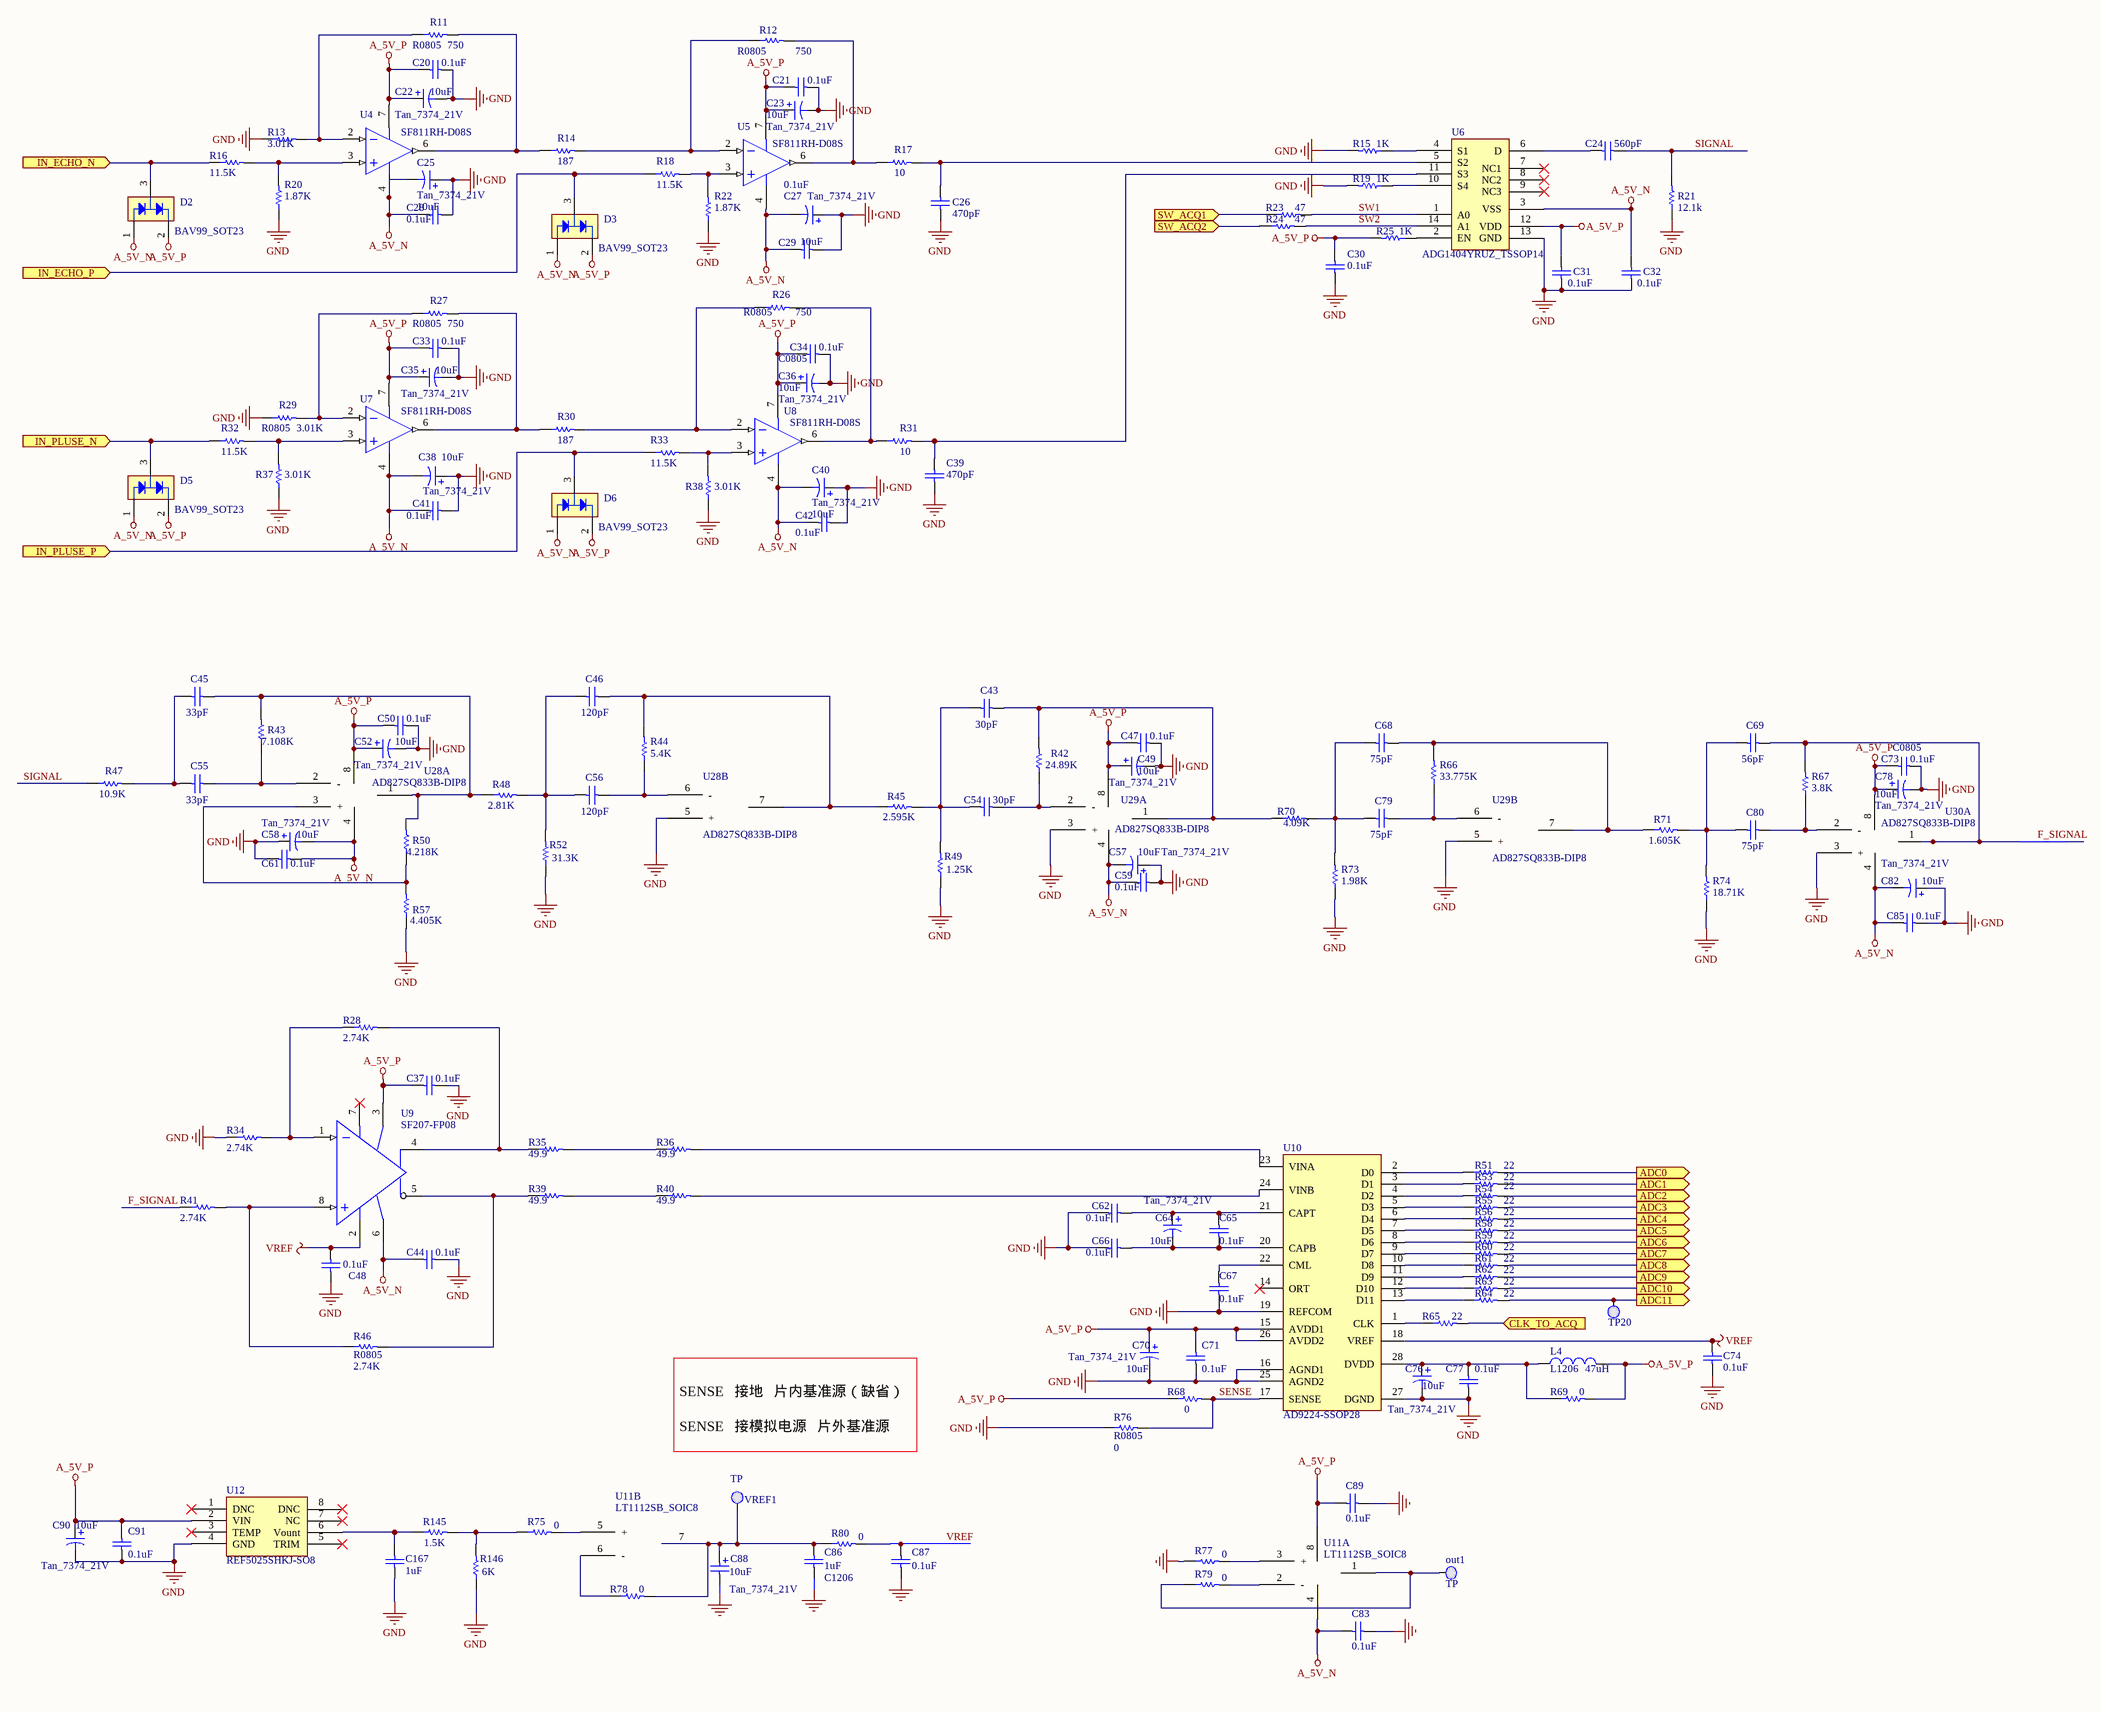
[diagram p3: EVENTCTRL_ACQ.SchDoc]

### Parts
C20  value 0.1uF  [0805]  (hidden comment: C0805)
C21  value 0.1uF  [0805]  (hidden comment: C0805)
C22  Tan_7374_21V  value 10uF  [7343]
C23  Tan_7374_21V  value 10uF  [7343]
C24  value 560pF  [0805]  (hidden comment: C0805)
C25  Tan_7374_21V  value 10uF  [7343]
C26  value 470pF  [0805]  (hidden comment: C0805)
C27  Tan_7374_21V  value 10uF  [7343]
C28  value 0.1uF  [0805]  (hidden comment: C0805)
C29  value 0.1uF  [0805]  (hidden comment: C0805)
C30  value 0.1uF  [0805]  (hidden comment: C0805)
C31  value 0.1uF  [0805]  (hidden comment: C0805)
C32  value 0.1uF  [0805]  (hidden comment: C0805)
C33  value 0.1uF  [0805]  (hidden comment: C0805)
C34  value 0.1uF  [0805]  (hidden comment: C0805)
C35  Tan_7374_21V  value 10uF  [7343]
C36  Tan_7374_21V  value 10uF  [7343]
C37  value 0.1uF  [0805]  (hidden comment: C0805)
C38  Tan_7374_21V  value 10uF  [7343]
C39  value 470pF  [0805]  (hidden comment: C0805)
C40  Tan_7374_21V  value 10uF  [7343]
C41  value 0.1uF  [0805]  (hidden comment: C0805)
C42  value 0.1uF  [0805]  (hidden comment: C0805)
C43  value 30pF  [0805]  (hidden comment: C0805)
C44  value 0.1uF  [0805]  (hidden comment: C0805)
C45  value 33pF  [0805]  (hidden comment: C0805)
C46  value 120pF  [0805]  (hidden comment: C0805)
C47  value 0.1uF  [0805]  (hidden comment: C0805)
C48  value 0.1uF  [0805]  (hidden comment: C0805)
C49  Tan_7374_21V  value 10uF  [7343]
C50  value 0.1uF  [0805]  (hidden comment: C0805)
C52  Tan_7374_21V  value 10uF  [7343]
C54  value 30pF  [0805]  (hidden comment: C0805)
C55  value 33pF  [0805]  (hidden comment: C0805)
C56  value 120pF  [0805]  (hidden comment: C0805)
C57  Tan_7374_21V  value 10uF  [7343]
C58  Tan_7374_21V  value 10uF  [7343]
C59  value 0.1uF  [0805]  (hidden comment: C0805)
C61  value 0.1uF  [0805]  (hidden comment: C0805)
C62  value 0.1uF  [0805]  (hidden comment: C0805)
C64  Tan_7374_21V  value 10uF  [7343]
C65  value 0.1uF  [0805]  (hidden comment: C0805)
C66  value 0.1uF  [0805]  (hidden comment: C0805)
C67  value 0.1uF  [0805]  (hidden comment: C0805)
C68  value 75pF  [0805]  (hidden comment: C0805)
C69  value 56pF  [0805]  (hidden comment: C0805)
C70  Tan_7374_21V  value 10uF  [7343]
C71  value 0.1uF  [0805]  (hidden comment: C0805)
C73  value 0.1uF  [0805]  (hidden comment: C0805)
C74  value 0.1uF  [0805]  (hidden comment: C0805)
C76  Tan_7374_21V  value 10uF  [7343]
C77  value 0.1uF  [0805]  (hidden comment: C0805)
C78  Tan_7374_21V  value 10uF  [7343]
C79  value 75pF  [0805]  (hidden comment: C0805)
C80  value 75pF  [0805]  (hidden comment: C0805)
C82  Tan_7374_21V  value 10uF  [7343]
C83  value 0.1uF  [0805]  (hidden comment: C0805)
C85  value 0.1uF  [0805]  (hidden comment: C0805)
C86  C1206  value 1uF  [1206]
C87  value 0.1uF  [0805]  (hidden comment: C0805)
C88  Tan_7374_21V  value 10uF  [7343]
C89  value 0.1uF  [0805]  (hidden comment: C0805)
C90  Tan_7374_21V  value 10uF  [7343]
C91  value 0.1uF  [0805]  (hidden comment: C0805)
C167  value 1uF  [1206]  (hidden comment: C1206)
D2  BAV99_SOT23  [SOT23-3N]
D3  BAV99_SOT23  [SOT23-3N]
D5  BAV99_SOT23  [SOT23-3N]
D6  BAV99_SOT23  [SOT23-3N]
L4  L1206  value 47uH  [1206]
out1  TP  [TPA]
R11  value 750  [R0805]  (hidden comment: R0805)
R12  R0805  value 750  [R0805]
R13  value 3.01K  [R0805]  (hidden comment: R0805)
R14  value 187  [R0805]  (hidden comment: R0805)
R15  value 1K  [R0805]  (hidden comment: R0805)
R16  value 11.5K  [R0805]  (hidden comment: R0805)
R17  value 10  [R0805]  (hidden comment: R0805)
R18  value 11.5K  [R0805]  (hidden comment: R0805)
R19  value 1K  [R0805]  (hidden comment: R0805)
R20  value 1.87K  [R0805]  (hidden comment: R0805)
R21  value 12.1k  [R0805]  (hidden comment: R0805)
R22  value 1.87K  [R0805]  (hidden comment: R0805)
R23  value 47  [R0805]  (hidden comment: R0805)
R24  value 47  [R0805]  (hidden comment: R0805)
R25  value 1K  [R0805]  (hidden comment: R0805)
R26  value 750  [R0805]  (hidden comment: R0805)
R27  value 750  [R0805]  (hidden comment: R0805)
R28  value 2.74K  [R0805]  (hidden comment: R0805)
R29  value 3.01K  [R0805]  (hidden comment: R0805)
R30  value 187  [R0805]  (hidden comment: R0805)
R31  value 10  [R0805]  (hidden comment: R0805)
R32  value 11.5K  [R0805]  (hidden comment: R0805)
R33  value 11.5K  [R0805]  (hidden comment: R0805)
R34  value 2.74K  [R0805]  (hidden comment: R0805)
R35  value 49.9  [R0805]  (hidden comment: R0805)
R36  value 49.9  [R0805]  (hidden comment: R0805)
R37  value 3.01K  [R0805]  (hidden comment: R0805)
R38  value 3.01K  [R0805]  (hidden comment: R0805)
R39  value 49.9  [R0805]  (hidden comment: R0805)
R40  value 49.9  [R0805]  (hidden comment: R0805)
R41  value 2.74K  [R0805]  (hidden comment: R0805)
R42  value 24.89K  [R0805]  (hidden comment: R0805)
R43  value 7.108K  [R0805]  (hidden comment: R0805)
R44  value 5.4K  [R0805]  (hidden comment: R0805)
R45  value 2.595K  [R0805]  (hidden comment: R0805)
R46  R0805  value 2.74K  [R0805]
R47  value 10.9K  [R0805]  (hidden comment: R0805)
R48  value 2.81K  [R0805]  (hidden comment: R0805)
R49  value 1.25K  [R0805]  (hidden comment: R0805)
R50  value 4.218K  [R0805]  (hidden comment: R0805)
R51  value 22  [R0805]  (hidden comment: R0805)
R52  value 31.3K  [R0805]  (hidden comment: R0805)
R53  value 22  [R0805]  (hidden comment: R0805)
R54  value 22  [R0805]  (hidden comment: R0805)
R55  value 22  [R0805]  (hidden comment: R0805)
R56  value 22  [R0805]  (hidden comment: R0805)
R57  value 4.405K  [R0805]  (hidden comment: R0805)
R58  value 22  [R0805]  (hidden comment: R0805)
R59  value 22  [R0805]  (hidden comment: R0805)
R60  value 22  [R0805]  (hidden comment: R0805)
R61  value 22  [R0805]  (hidden comment: R0805)
R62  value 22  [R0805]  (hidden comment: R0805)
R63  value 22  [R0805]  (hidden comment: R0805)
R64  value 22  [R0805]  (hidden comment: R0805)
R65  value 22  [R0805]  (hidden comment: R0805)
R66  value 33.775K  [R0805]  (hidden comment: R0805)
R67  value 3.8K  [R0805]  (hidden comment: R0805)
R68  value 0  [R0805]  (hidden comment: R0805)
R69  value 0  [R0805]  (hidden comment: R0805)
R70  value 4.09K  [R0805]  (hidden comment: R0805)
R71  value 1.605K  [R0805]  (hidden comment: R0805)
R73  value 1.98K  [R0805]  (hidden comment: R0805)
R74  value 18.71K  [R0805]  (hidden comment: R0805)
R75  value 0  [R0805]  (hidden comment: R0805)
R76  value 0  [R0805]  (hidden comment: R0805)
R77  value 0  [R0805]  (hidden comment: R0805)
R78  value 0  [R0805]  (hidden comment: R0805)
R79  value 0  [R0805]  (hidden comment: R0805)
R80  value 0  [R0805]  (hidden comment: R0805)
R145  value 1.5K  [R0805]  (hidden comment: R0805)
R146  value 6K  [R0805]  (hidden comment: R0805)
TP20  TP  [TPA]  (value not drawn)
U4  SF811RH-D08S  [DIP8]
U5  SF811RH-D08S  [DIP8]
U6  ADG1404YRUZ_TSSOP14  [TSSOP14]
U7  SF811RH-D08S  [DIP8]
U8  SF811RH-D08S  [DIP8]
U9  SF207-FP08  [SO-8]
U10  AD9224-SSOP28  [TSSOP28]
U11  LT1112SB_SOIC8  [SO-8]  (parts A,B of 2)
U12  REF5025SHKJ-SO8  [SO8-HKJ]
U28  AD827SQ833B-DIP8  [DIP8]  (parts A,B of 2)
U29  AD827SQ833B-DIP8  [DIP8]  (parts A,B of 2)
U30  AD827SQ833B-DIP8  [DIP8]  (part A of 2)
VREF1  TP  [TPA]

### Ports
ADC0 (out), ADC1 (out), ADC2 (out), ADC3 (out), ADC4 (out), ADC5 (out), ADC6 (out), ADC7 (out), ADC8 (out), ADC9 (out), ADC10 (out), ADC11 (out), CLK_TO_ACQ (in), IN_ECHO_N (in), IN_ECHO_P (in), IN_PLUSE_N (in), IN_PLUSE_P (in), SW_ACQ1 (in), SW_ACQ2 (in)

### Nets
A_5V_N: C25.2 C27.2 C28.1 C29.1 C32.1 C38.2 C40.2 C41.1 C42.1 C44.1 C57.2 C58.2 C59.1 C61.2 C82.2 C83.2 C85.1 D2.1 D3.1 D5.1 D6.1 U4.4(-VS) U5.4(-VS) U6.3(VSS) U7.4(-VS) U8.4(-VS) U9.6(V-) U11.4 U28.4 U29.4 U30.4
A_5V_P: C20.1 C21.1 C22.1 C23.1 C30.1 C31.1 C33.1 C34.1 C35.1 C36.1 C37.1 C47.1 C49.1 C50.1 C52.1 C70.1 C71.1 C73.1 C78.1 C89.1 C90.1 C91.2 D2.2 D3.2 D5.2 D6.2 L4.2 R25.2 R68.1 R69.2 U4.7(+VS) U5.7(+VS) U6.12(VDD) U7.7(+VS) U8.7(+VS) U9.3(V+) U10.15(AVDD1) U10.26(AVDD2) U11.8 U12.2(VIN) U28.8 U29.8 U30.8
GND: C20.2 C21.2 C22.2 C23.2 C25.1 C26.2 C27.1 C28.2 C29.2 C30.2 C31.2 C32.2 C33.2 C34.2 C35.2 C36.2 C37.2 C38.1 C39.2 C40.1 C41.2 C42.2 C44.2 C47.2 C48.2 C49.2 C50.2 C52.2 C57.1 C58.1 C59.2 C61.1 C62.1 C66.1 C67.2 C70.2 C71.2 C73.2 C74.2 C76.2 C77.2 C78.2 C82.1 C83.1 C85.2 C86.2 C87.2 C88.2 C89.2 C90.2 C91.1 C167.1 R13.1 R15.2 R19.2 R20.1 R21.1 R22.1 R29.1 R34.1 R37.1 R38.1 R49.1 R52.1 R57.1 R73.1 R74.1 R76.1 R77.1 R146.1 U6.13(GND) U10.16(AGND1) U10.19(REFCOM) U10.25(AGND2) U10.27(DGND) U12.4(GND) U28.5(+) U29.3(+) U29.5(+) U30.3(+)
VREF: C48.1 C74.1 C87.1 R80.2 U9.2(Vcom) U10.18(VREF)
ADC0: R51.2 ; port ADC0
ADC1: R53.2 ; port ADC1
ADC2: R54.2 ; port ADC2
ADC3: R55.2 ; port ADC3
ADC4: R56.2 ; port ADC4
ADC5: R58.2 ; port ADC5
ADC6: R59.2 ; port ADC6
ADC7: R60.2 ; port ADC7
ADC8: R61.2 ; port ADC8
ADC9: R62.2 ; port ADC9
ADC10: R63.2 ; port ADC10
ADC11: R64.2 TP20.1(TP) ; port ADC11
CLK_TO_ACQ: R65.2 ; port CLK_TO_ACQ
F_SIGNAL: C69.2 R41.1 R67.2 U30.1(OUTA)
IN_ECHO_N: D2.3 R16.1 ; port IN_ECHO_N
IN_ECHO_P: D3.3 R18.1 ; port IN_ECHO_P
IN_PLUSE_N: D5.3 R32.1 ; port IN_PLUSE_N
IN_PLUSE_P: D6.3 R33.1 ; port IN_PLUSE_P
SENSE: R68.2 R76.2 U10.17(SENSE)
SIGNAL: C24.2 R21.2 R47.1
SW1: R23.2 U6.1(A0)
SW2: R24.2 U6.14(A1)
SW_ACQ1: R23.1 ; port SW_ACQ1
SW_ACQ2: R24.1 ; port SW_ACQ2
NetC24_1: C24.1 U6.6(D)
NetC26_1: C26.1 R17.2 U6.5(S2)
NetC39_1: C39.1 R31.2 U6.11(S3)
NetC43_1: C43.1 C54.1 R45.2 R49.2
NetC43_2: C43.2 R42.2 R70.1 U29.1(OUTA)
NetC45_1: C45.1 R43.2 R48.1 R50.2 U28.1(OUTA)
NetC45_2: C45.2 C55.2 R47.2
NetC46_1: C46.1 C56.1 R48.2 R52.2
NetC46_2: C46.2 R44.2 R45.1 U28.7(OUTB)
NetC54_2: C54.2 R42.1 U29.2(-)
NetC55_1: C55.1 R43.1 U28.2(-)
NetC56_2: C56.2 R44.1 U28.6(-)
NetC62_2: C62.2 C64.1 C65.1 U10.21(CAPT)
NetC64_2: C64.2 C65.2 C66.2 U10.20(CAPB)
NetC67_1: C67.1 U10.22(CML)
NetC68_1: C68.1 C79.1 R70.2 R73.2
NetC68_2: C68.2 R66.2 R71.1 U29.7(OUTB)
NetC69_1: C69.1 C80.1 R71.2 R74.2
NetC76_1: C76.1 C77.1 L4.1 R69.1 U10.28(DVDD)
NetC79_2: C79.2 R66.1 U29.6(-)
NetC80_2: C80.2 R67.1 U30.2(-)
NetC86_1: C86.1 C88.1 R78.2 R80.1 U11.7(OUTB) VREF1.1(TP)
NetC167_2: C167.2 R145.1 U12.6(Vount)
Netout1_1: out1.1(TP) R79.1 U11.1(OUTA)
NetR11_1: R11.1 R13.2 U4.2(-IN)
NetR11_2: R11.2 R14.1 U4.6(OUT)
NetR12_1: R12.1 R14.2 U5.2(-IN)
NetR12_2: R12.2 R17.1 U5.6(OUT)
NetR15_1: R15.1 U6.4(S1)
NetR16_2: R16.2 R20.2 U4.3(+IN)
NetR18_2: R18.2 R22.2 U5.3(+IN)
NetR19_1: R19.1 U6.10(S4)
NetR25_1: R25.1 U6.2(EN)
NetR26_1: R26.1 R30.2 U8.2(-IN)
NetR26_2: R26.2 R31.1 U8.6(OUT)
NetR27_1: R27.1 R29.2 U7.2(-IN)
NetR27_2: R27.2 R30.1 U7.6(OUT)
NetR28_1: R28.1 R34.2 U9.1(Din-)
NetR28_2: R28.2 R35.1 U9.4(OUT+)
NetR32_2: R32.2 R37.2 U7.3(+IN)
NetR33_2: R33.2 R38.2 U8.3(+IN)
NetR35_2: R35.2 R36.1
NetR36_2: R36.2 U10.23(VINA)
NetR39_1: R39.1 R46.2 U9.5(OUT-)
NetR39_2: R39.2 R40.1
NetR40_2: R40.2 U10.24(VINB)
NetR41_2: R41.2 R46.1 U9.8(Din+)
NetR50_1: R50.1 R57.2 U28.3(+)
NetR51_1: R51.1 U10.2(D0)
NetR53_1: R53.1 U10.3(D1)
NetR54_1: R54.1 U10.4(D2)
NetR55_1: R55.1 U10.5(D3)
NetR56_1: R56.1 U10.6(D4)
NetR58_1: R58.1 U10.7(D5)
NetR59_1: R59.1 U10.8(D6)
NetR60_1: R60.1 U10.9(D7)
NetR61_1: R61.1 U10.10(D8)
NetR62_1: R62.1 U10.11(D9)
NetR63_1: R63.1 U10.12(D10)
NetR64_1: R64.1 U10.13(D11)
NetR65_1: R65.1 U10.1(CLK)
NetR75_1: R75.1 R145.2 R146.2
NetR75_2: R75.2 U11.5(+)
NetR77_2: R77.2 U11.3(+)
NetR78_1: R78.1 U11.6(-)
NetR79_2: R79.2 U11.2(-)

Not connected (* = marked no-connect by the designer): U6 7(NC1)* 8(NC2)* 9(NC3)*; U9 7(NC)*; U10 14(ORT)*; U12 1(DNC)* 3(TEMP)* 5(TRIM)* 7(NC)* 8(DNC)*

### Notes on the sheet
- SENSE   接地   片内基准源（缺省）
- SENSE   接模拟电源   片外基准源

### Library data of the parts
C20 C21 C24 C26 C28-C34 C37 C39 C41-C48 C50 C54-C56 C59 C61 C62 C65-C69 C71 C73 C74 C77 C79 C80 C85 C91 C167 = Cap: Capacitor
  C20 C21 C24 C26 C28-C34 C37 C39 C41 C42 C44 C47 C48 C50 C59 C61 C62 C65-C67 C71 C73 C74 C77 C85 C91: PackageReference: C0805
  C43 C45 C46 C54-C56 C68 C69 C79 C80: Published: 8-Jun-2000; LatestRevisionDate: 17-Jul-2002; LatestRevisionNote: Re-released for DXP Platform.; PackageReference: RAD-0.3; Publisher: Altium Limited; PackageDescription: Radial Cap, Thru-Hole; 2 Leads; 0.3 in Pin Spacing
  C167: PackageReference: C1206
C22 C23 C25 C27 C35 C36 C38 C40 C49 C52 C58 C78 C90 = Cap Pol3: Polarized Capacitor (Surface Mount); 耐压值: 21V; Published: 8-Jun-2000; LatestRevisionDate: 17-Jul-2002; LatestRevisionNote: Re-released for DXP Platform.; PackageReference: C0805; Publisher: Altium Limited
C57 C82 = Cap Pol3: Polarized Capacitor (Surface Mount); Published: 8-Jun-2000; LatestRevisionDate: 17-Jul-2002; LatestRevisionNote: Re-released for DXP Platform.; PackageReference: C0805; Publisher: Altium Limited
C64 = Cap Pol1: Polarized Capacitor (Radial); 耐压值: 21V
C70 C76 = Cap Pol1: Polarized Capacitor (Radial)
C83 C86 C87 C89 = Y20021820: Capacitor; 制造商型号: 08053C104K4Z; 精度: ±10%; 描述: AVX;08053C104K4Z;0.1uF;±10%;25V;X7R;125℃;CAP0805; 安装形式: SMT; 产品外形尺寸<长>: 2.0±0.2mm; 产品外形尺寸<宽>: 1.25±0.2mm; 产品外形尺寸<高>: 0.94mm; id: wt.part.WTPartMaster:1051426; state: APPROVED; folder: /Default/电容/0805YC104JAT; Part Number: Y20021820; HelpURL: \\10.185.226.160\altium_center_db\DATASHEET\AVX Automotive MLCC.pdf; pname: 08053C104K4Z
C88 = Y20024818: Polarized Capacitor; 制造商型号: T499D106K050AT; 精度: ±10%; 描述: KEMET;T499D106K050AT;10uF;±10%;50V;175℃;CAP2917; 安装形式: SMT; 产品外形尺寸<长>: 7.3±0.30mm; 产品外形尺寸<宽>: 4.3±0.30mm; 产品外形尺寸<高>: 2.8±0.30mm; id: wt.part.WTPartMaster:1056718; state: APPROVED; folder: /Default/电容/T499D106K050AT; 耐压值: 21V; Part Number: Y20024818; HelpURL: \\10.185.226.160\altium_center_db\DATASHEET\KEMET T498&T499ns.pdf; pname: T499D106K050AT
D2 D3 D5 D6 = BAV99LT1
L4 = Inductor
R11-R71 R73-R80 R145 R146 = Res1: Resistor
  R11 R13 R15-R41 R65 R68 R69 R76: PackageReference: R0805
  R12 R14 R51 R53-R56 R58-R64: Published: 8-Jun-2000; LatestRevisionDate: 17-Jul-2002; LatestRevisionNote: Re-released for DXP Platform.; PackageReference: AXIAL-0.3; Publisher: Altium Limited
  R42-R45 R47-R50 R52 R57 R66 R67 R70 R71 R73-R75 R77-R80 R145 R146: Published: 8-Jun-2000; LatestRevisionDate: 17-Jul-2002; LatestRevisionNote: Re-released for DXP Platform.; PackageReference: AXIAL-0.3; Publisher: Altium Limited; PackageDescription: Axial Device, Thru-Hole; 2 Leads; 0.3 in Pin Spacing
U4 U5 U7 U8 = AD811
U6 = ADG1404
U9 = SF207
U10 = AD9224
U11 = LT1112SB
U12 = Component_1
U28-U30 = AD827

## Sheet EVENTCTRL_DSP.SchDoc: DSP
size A3; Author: ZLY; DocumentNumber: 9321-E-1102-EMRT EVENT CONTROLLER ACQ; Revision: 1.0; SheetNumber: 5; SheetTotal: 6
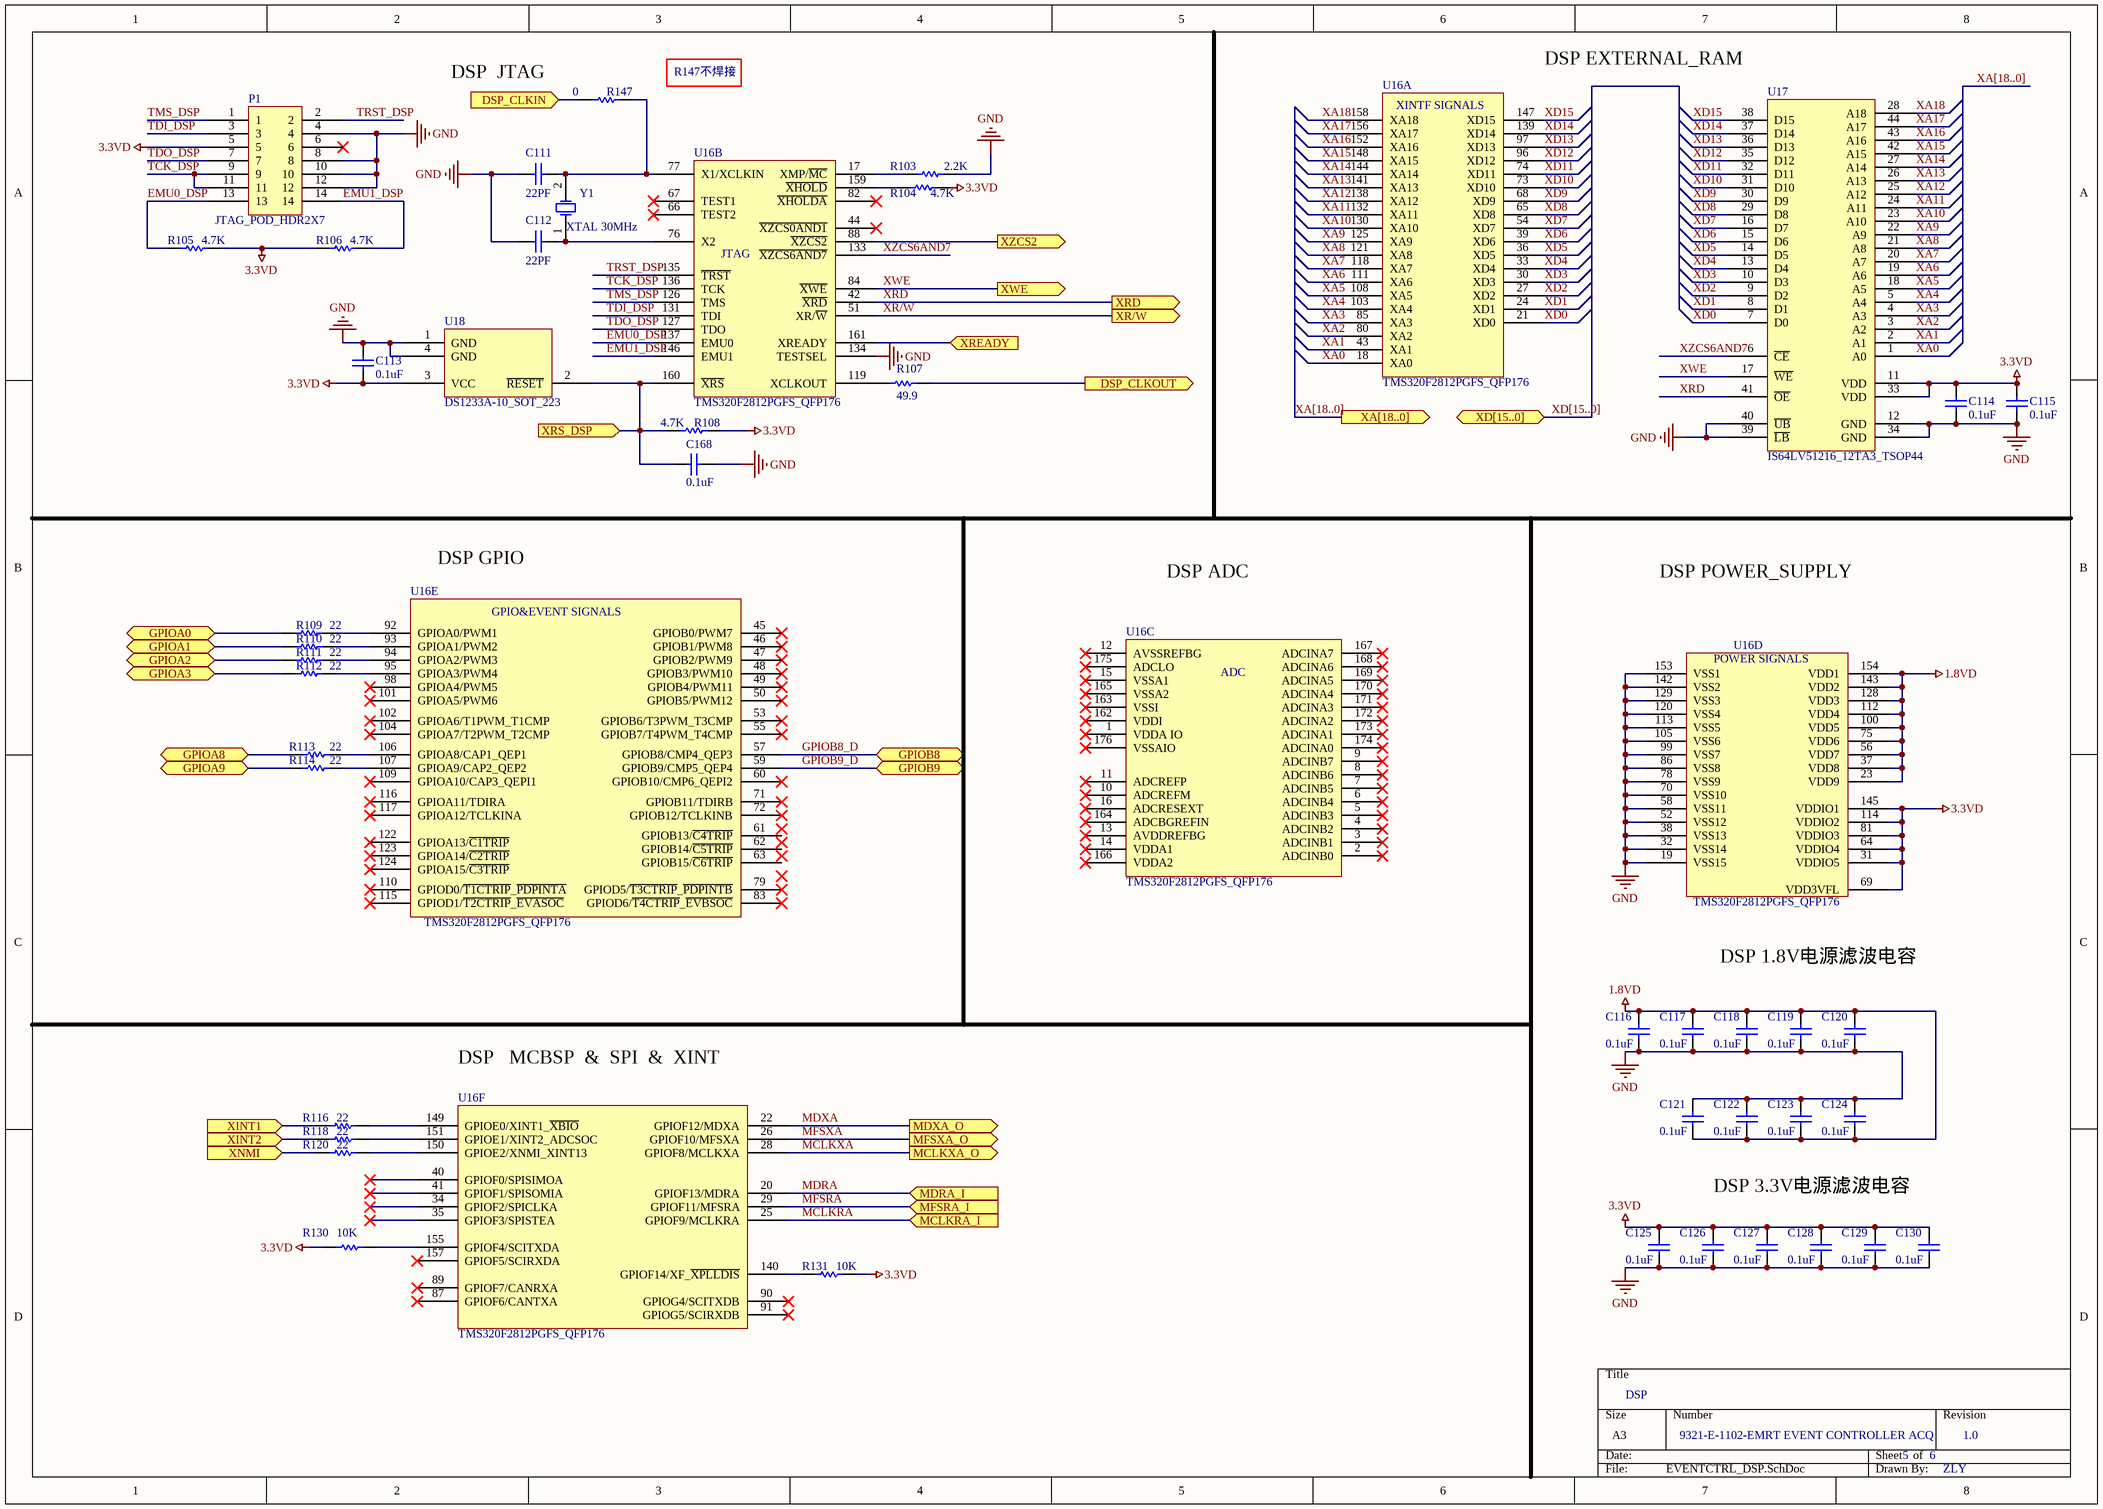
[diagram p4: EVENTCTRL_DSP.SchDoc]

### Parts
C111  value 22PF  [0805]  (hidden comment: C0805)
C112  value 22PF  [0805]  (hidden comment: C0805)
C113  value 0.1uF  [0805]  (hidden comment: C0805)
C114  value 0.1uF  [0805]  (hidden comment: C0805)
C115  value 0.1uF  [0805]  (hidden comment: C0805)
C116  value 0.1uF  [0805]  (hidden comment: C0805)
C117  value 0.1uF  [0805]  (hidden comment: C0805)
C118  value 0.1uF  [0805]  (hidden comment: C0805)
C119  value 0.1uF  [0805]  (hidden comment: C0805)
C120  value 0.1uF  [0805]  (hidden comment: C0805)
C121  value 0.1uF  [0805]  (hidden comment: C0805)
C122  value 0.1uF  [0805]  (hidden comment: C0805)
C123  value 0.1uF  [0805]  (hidden comment: C0805)
C124  value 0.1uF  [0805]  (hidden comment: C0805)
C125  value 0.1uF  [0805]  (hidden comment: C0805)
C126  value 0.1uF  [0805]  (hidden comment: C0805)
C127  value 0.1uF  [0805]  (hidden comment: C0805)
C128  value 0.1uF  [0805]  (hidden comment: C0805)
C129  value 0.1uF  [0805]  (hidden comment: C0805)
C130  value 0.1uF  [0805]  (hidden comment: C0805)
C168  value 0.1uF  [0805]  (hidden comment: C0805)
P1  JTAG_POD_HDR2X7  [HDR2X7]
R103  value 2.2K  [R0805]  (hidden comment: R0805)
R104  value 4.7K  [R0805]  (hidden comment: R0805)
R105  value 4.7K  [R0805]  (hidden comment: R0805)
R106  value 4.7K  [R0805]  (hidden comment: R0805)
R107  value 49.9  [R0805]  (hidden comment: R0805)
R108  value 4.7K  [R0805]  (hidden comment: R0805)
R109  value 22  [R0805]  (hidden comment: R0805)
R110  value 22  [R0805]  (hidden comment: R0805)
R111  value 22  [R0805]  (hidden comment: R0805)
R112  value 22  [R0805]  (hidden comment: R0805)
R113  value 22  [R0805]  (hidden comment: R0805)
R114  value 22  [R0805]  (hidden comment: R0805)
R116  value 22  [R0805]  (hidden comment: R0805)
R118  value 22  [R0805]  (hidden comment: R0805)
R120  value 22  [R0805]  (hidden comment: R0805)
R130  value 10K  [R0805]  (hidden comment: R0805)
R131  value 10K  [R0805]  (hidden comment: R0805)
R147  value 0  [R0805]  (hidden comment: R0805)
U16  TMS320F2812PGFS_QFP176  [QFP176]  (parts A,B,C,D,E,F of 6)
U17  IS64LV51216_12TA3_TSOP44  [TSOP44]
U18  DS1233A-10_SOT_223  [SOT-223]
Y1  XTAL 30MHz  [R38]

### Ports
DSP_CLKIN (in), DSP_CLKOUT (out), GPIOA0 (bidir), GPIOA1 (bidir), GPIOA2 (bidir), GPIOA3 (bidir), GPIOA8 (bidir), GPIOA9 (bidir), GPIOB8 (bidir), GPIOB9 (bidir), MCLKRA_I (in), MCLKXA_O (out), MDRA_I (in), MDXA_O (out), MFSRA_I (in), MFSXA_O (out), XA[18..0] (out), XD[15..0] (bidir), XINT1 (in), XINT2 (in), XNMI (in), XR/W (out), XRD (out), XREADY (in), XRS_DSP (in), XWE (out), XZCS2 (out)

### Nets
1.8VD: C116.1 C117.1 C118.1 C119.1 C120.1 C121.2 C122.2 C123.2 C124.2 U16.23(VDD9) U16.37(VDD8) U16.56(VDD7) U16.75(VDD6) U16.100(VDD5) U16.112(VDD4) U16.128(VDD3) U16.143(VDD2) U16.154(VDD1)
3.3VD: C113.1 C114.2 C115.2 C125.1 C126.1 C127.1 C128.1 C129.1 C130.1 P1.5 R104.1 R105.2 R106.1 R108.1 R130.1 R131.1 U16.31(VDDIO5) U16.64(VDDIO4) U16.69(VDD3VFL) U16.81(VDDIO3) U16.114(VDDIO2) U16.145(VDDIO1) U17.11(VDD) U17.33(VDD) U18.3(VCC)
GND: C111.1 C112.1 C113.2 C114.1 C115.1 C116.2 C117.2 C118.2 C119.2 C120.2 C121.1 C122.1 C123.1 C124.1 C125.2 C126.2 C127.2 C128.2 C129.2 C130.2 C168.2 P1.4 P1.8 P1.10 P1.12 R103.1 U16.19(VSS15) U16.32(VSS14) U16.38(VSS13) U16.52(VSS12) U16.58(VSS11) U16.70(VSS10) U16.78(VSS9) U16.86(VSS8) U16.99(VSS7) U16.105(VSS6) U16.113(VSS5) U16.120(VSS4) U16.129(VSS3) U16.134(TESTSEL) U16.142(VSS2) U16.153(VSS1) U17.12(GND) U17.34(GND) U17.39(~{LB}) U17.40(~{UB}) U18.1(GND) U18.4(GND)
EMU0_DSP: P1.13 R105.1 U16.137(EMU0)
EMU1_DSP: P1.14 R106.2 U16.146(EMU1)
GPIOB8_D: U16.57(GPIOB8/CMP4_QEP3) ; port GPIOB8  [project net GPIOB8]
GPIOB9_D: U16.59(GPIOB9/CMP5_QEP4) ; port GPIOB9  [project net GPIOB9]
MCLKRA: U16.25(GPIOF9/MCLKRA) ; port MCLKRA_I
MCLKXA: U16.28(GPIOF8/MCLKXA) ; port MCLKXA_O
MDRA: U16.20(GPIOF13/MDRA) ; port MDRA_I
MDXA: U16.22(GPIOF12/MDXA) ; port MDXA_O
MFSRA: U16.29(GPIOF11/MFSRA) ; port MFSRA_I
MFSXA: U16.26(GPIOF10/MFSXA) ; port MFSXA_O
TCK_DSP: P1.9 P1.11 U16.136(TCK)
TDI_DSP: P1.3 U16.131(TDI)
TDO_DSP: P1.7 U16.127(TDO)
TMS_DSP: P1.1 U16.126(TMS)
TRST_DSP: P1.2 U16.135(~{TRST})
XA0: U16.18(XA0) U17.1(A0)
XA1: U16.43(XA1) U17.2(A1)
XA2: U16.80(XA2) U17.3(A2)
XA3: U16.85(XA3) U17.4(A3)
XA4: U16.103(XA4) U17.5(A4)
XA5: U16.108(XA5) U17.18(A5)
XA6: U16.111(XA6) U17.19(A6)
XA7: U16.118(XA7) U17.20(A7)
XA8: U16.121(XA8) U17.21(A8)
XA9: U16.125(XA9) U17.22(A9)
XA10: U16.130(XA10) U17.23(A10)
XA11: U16.132(XA11) U17.24(A11)
XA12: U16.138(XA12) U17.25(A12)
XA13: U16.141(XA13) U17.26(A13)
XA14: U16.144(XA14) U17.27(A14)
XA15: U16.148(XA15) U17.42(A15)
XA16: U16.152(XA16) U17.43(A16)
XA17: U16.156(XA17) U17.44(A17)
XA18: U16.158(XA18) U17.28(A18)
XD0: U16.21(XD0) U17.7(D0)
XD1: U16.24(XD1) U17.8(D1)
XD2: U16.27(XD2) U17.9(D2)
XD3: U16.30(XD3) U17.10(D3)
XD4: U16.33(XD4) U17.13(D4)
XD5: U16.36(XD5) U17.14(D5)
XD6: U16.39(XD6) U17.15(D6)
XD7: U16.54(XD7) U17.16(D7)
XD8: U16.65(XD8) U17.29(D8)
XD9: U16.68(XD9) U17.30(D9)
XD10: U16.73(XD10) U17.31(D10)
XD11: U16.74(XD11) U17.32(D11)
XD12: U16.96(XD12) U17.35(D12)
XD13: U16.97(XD13) U17.36(D13)
XD14: U16.139(XD14) U17.37(D14)
XD15: U16.147(XD15) U17.38(D15)
XR/W: U16.51(XR/~{W}) ; port XR/W
XRD: U16.42(~{XRD}) U17.41(~{OE}) ; port XRD
XRS_DSP: C168.1 R108.2 U16.160(~{XRS}) U18.2(~{RESET}) ; port XRS_DSP
XWE: U16.84(~{XWE}) U17.17(~{WE}) ; port XWE
XZCS6AND7: U16.133(~{XZCS6AND7}) U17.6(~{CE})
NetC111_2: C111.2 R147.1 U16.77(X1/XCLKIN) Y1.2(OSC2)
NetC112_2: C112.2 U16.76(X2) Y1.1(OSC1)
NetR103_2: R103.2 U16.17(XMP/~{MC})
NetR104_2: R104.2 U16.159(~{XHOLD})
NetR107_1: R107.1 ; port DSP_CLKOUT
NetR107_2: R107.2 U16.119(XCLKOUT)
NetR109_1: R109.1 ; port GPIOA0
NetR109_2: R109.2 U16.92(GPIOA0/PWM1)
NetR110_1: R110.1 ; port GPIOA1
NetR110_2: R110.2 U16.93(GPIOA1/PWM2)
NetR111_1: R111.1 ; port GPIOA2
NetR111_2: R111.2 U16.94(GPIOA2/PWM3)
NetR112_1: R112.1 ; port GPIOA3
NetR112_2: R112.2 U16.95(GPIOA3/PWM4)
NetR113_1: R113.1 ; port GPIOA8
NetR113_2: R113.2 U16.106(GPIOA8/CAP1_QEP1)
NetR114_1: R114.1 ; port GPIOA9
NetR114_2: R114.2 U16.107(GPIOA9/CAP2_QEP2)
NetR116_1: R116.1 ; port XINT1
NetR116_2: R116.2 U16.149(GPIOE0/XINT1_~{XBIO})
NetR118_1: R118.1 ; port XINT2
NetR118_2: R118.2 U16.151(GPIOE1/XINT2_ADCSOC)
NetR120_1: R120.1 ; port XNMI
NetR120_2: R120.2 U16.150(GPIOE2/XNMI_XINT13)
NetR130_2: R130.2 U16.155(GPIOF4/SCITXDA)
NetR131_2: R131.2 U16.140(GPIOF14/XF_~{XPLLDIS})
NetR134_1: R147.2 ; port DSP_CLKIN
NetU16_88: U16.88(~{XZCS2}) ; port XZCS2
NetU16_161: U16.161(XREADY) ; port XREADY

Not connected (* = marked no-connect by the designer): P1 6*; U16 1(VDDA_IO)* 2(ADCINB0)* 3(ADCINB1)* 4(ADCINB2)* 5(ADCINB3)* 6(ADCINB4)* 7(ADCINB5)* 8(ADCINB6)* 9(ADCINB7)* 10(ADCREFM)* 11(ADCREFP)* 12(AVSSREFBG)* 13(AVDDREFBG)* 14(VDDA1)* 15(VSSA1)* 16(ADCRESEXT)* 34(GPIOF2/SPICLKA)* 35(GPIOF3/SPISTEA)* 40(GPIOF0/SPISIMOA)* 41(GPIOF1/SPISOMIA)* 44(~{XZCS0AND1})* 45(GPIOB0/PWM7)* 46(GPIOB1/PWM8)* 47(GPIOB2/PWM9)* 48(GPIOB3/PWM10)* 49(GPIOB4/PWM11)* 50(GPIOB5/PWM12)* 53(GPIOB6/T3PWM_T3CMP)* 55(GPIOB7/T4PWM_T4CMP)* 60(GPIOB10/CMP6_QEPI2)* 61(GPIOB13/~{C4TRIP}) 62(GPIOB14/~{C5TRIP}) 63(GPIOB15/~{C6TRIP}) 66(TEST2)* 67(TEST1)* 71(GPIOB11/TDIRB)* 72(GPIOB12/TCLKINB)* 79(GPIOD5/~{T3CTRIP}_~{PDPINTB})* 82(~{XHOLDA})* 83(GPIOD6/~{T4CTRIP}_~{EVBSOC})* 87(GPIOF6/CANTXA)* 89(GPIOF7/CANRXA)* 90(GPIOG4/SCITXDB)* 91(GPIOG5/SCIRXDB)* 98(GPIOA4/PWM5)* 101(GPIOA5/PWM6)* 102(GPIOA6/T1PWM_T1CMP)* 104(GPIOA7/T2PWM_T2CMP)* 109(GPIOA10/CAP3_QEPI1)* 110(GPIOD0/~{T1CTRIP}_~{PDPINTA})* 115(GPIOD1/~{T2CTRIP}_~{EVASOC})* 116(GPIOA11/TDIRA)* 117(GPIOA12/TCLKINA)* 122(GPIOA13/~{C1TRIP})* 123(GPIOA14/~{C2TRIP})* 124(GPIOA15/~{C3TRIP})* 157(GPIOF5/SCIRXDA)* 162(VDDI)* 163(VSSI)* 164(ADCBGREFIN)* 165(VSSA2)* 166(VDDA2)* 167(ADCINA7)* 168(ADCINA6)* 169(ADCINA5)* 170(ADCINA4)* 171(ADCINA3)* 172(ADCINA2)* 173(ADCINA1)* 174(ADCINA0)* 175(ADCLO)* 176(VSSAIO)*

### Buses and harness runs
bus XA[18..0]
bus XA[18..0] = port XA[18..0]
bus XD[15..0] = port XD[15..0]

### Notes on the sheet
- (near R147) DSP  JTAG
- R147不焊接
- DSP EXTERNAL_RAM
- DSP GPIO
- DSP ADC
- DSP POWER_SUPPLY
- DSP 1.8V电源滤波电容
- DSP   MCBSP  &  SPI  &  XINT
- DSP 3.3V电源滤波电容
- (in symbol TMS320F2812(176PIN), part A) XINTF SIGNALS
- (in symbol TMS320F2812(176PIN), part B) JTAG
- (in symbol TMS320F2812(176PIN), part C) ADC
- (in symbol TMS320F2812(176PIN), part D) POWER SIGNALS
- (in symbol TMS320F2812(176PIN), part E) GPIO&EVENT SIGNALS

### Library data of the parts
C111-C130 C168 = Cap: Capacitor; PackageReference: C0805
P1 = JTAG_POD
R103-R114 R116 R118 R120 R130 R131 R147 = Res1: Resistor
  R103-R108 R113 R114 R116 R118 R120 R130 R131 R147: PackageReference: R0805
  R109-R112: Published: 8-Jun-2000; LatestRevisionDate: 17-Jul-2002; LatestRevisionNote: Re-released for DXP Platform.; PackageReference: AXIAL-0.3; Publisher: Altium Limited
U16 = TMS320F2812(176PIN)
U17 = IS61LV51216
U18 = DS1233AZ-15
Y1 = XTAL: Crystal Oscillator; Published: 8-Jun-2000; LatestRevisionDate: 17-Jul-2002; LatestRevisionNote: Re-released for DXP Platform.; PackageReference: R38; Publisher: Altium Limited